# EasyEDA Pro project 4T模拟赛-董海玄.epro

# Schematic SCH
Board Name: Board1; Create Date: 2026-02-26; Page Name: GD32 主控电路; Project Name: Project; Schematic Name: SCH; Update Date: 2026-03-06
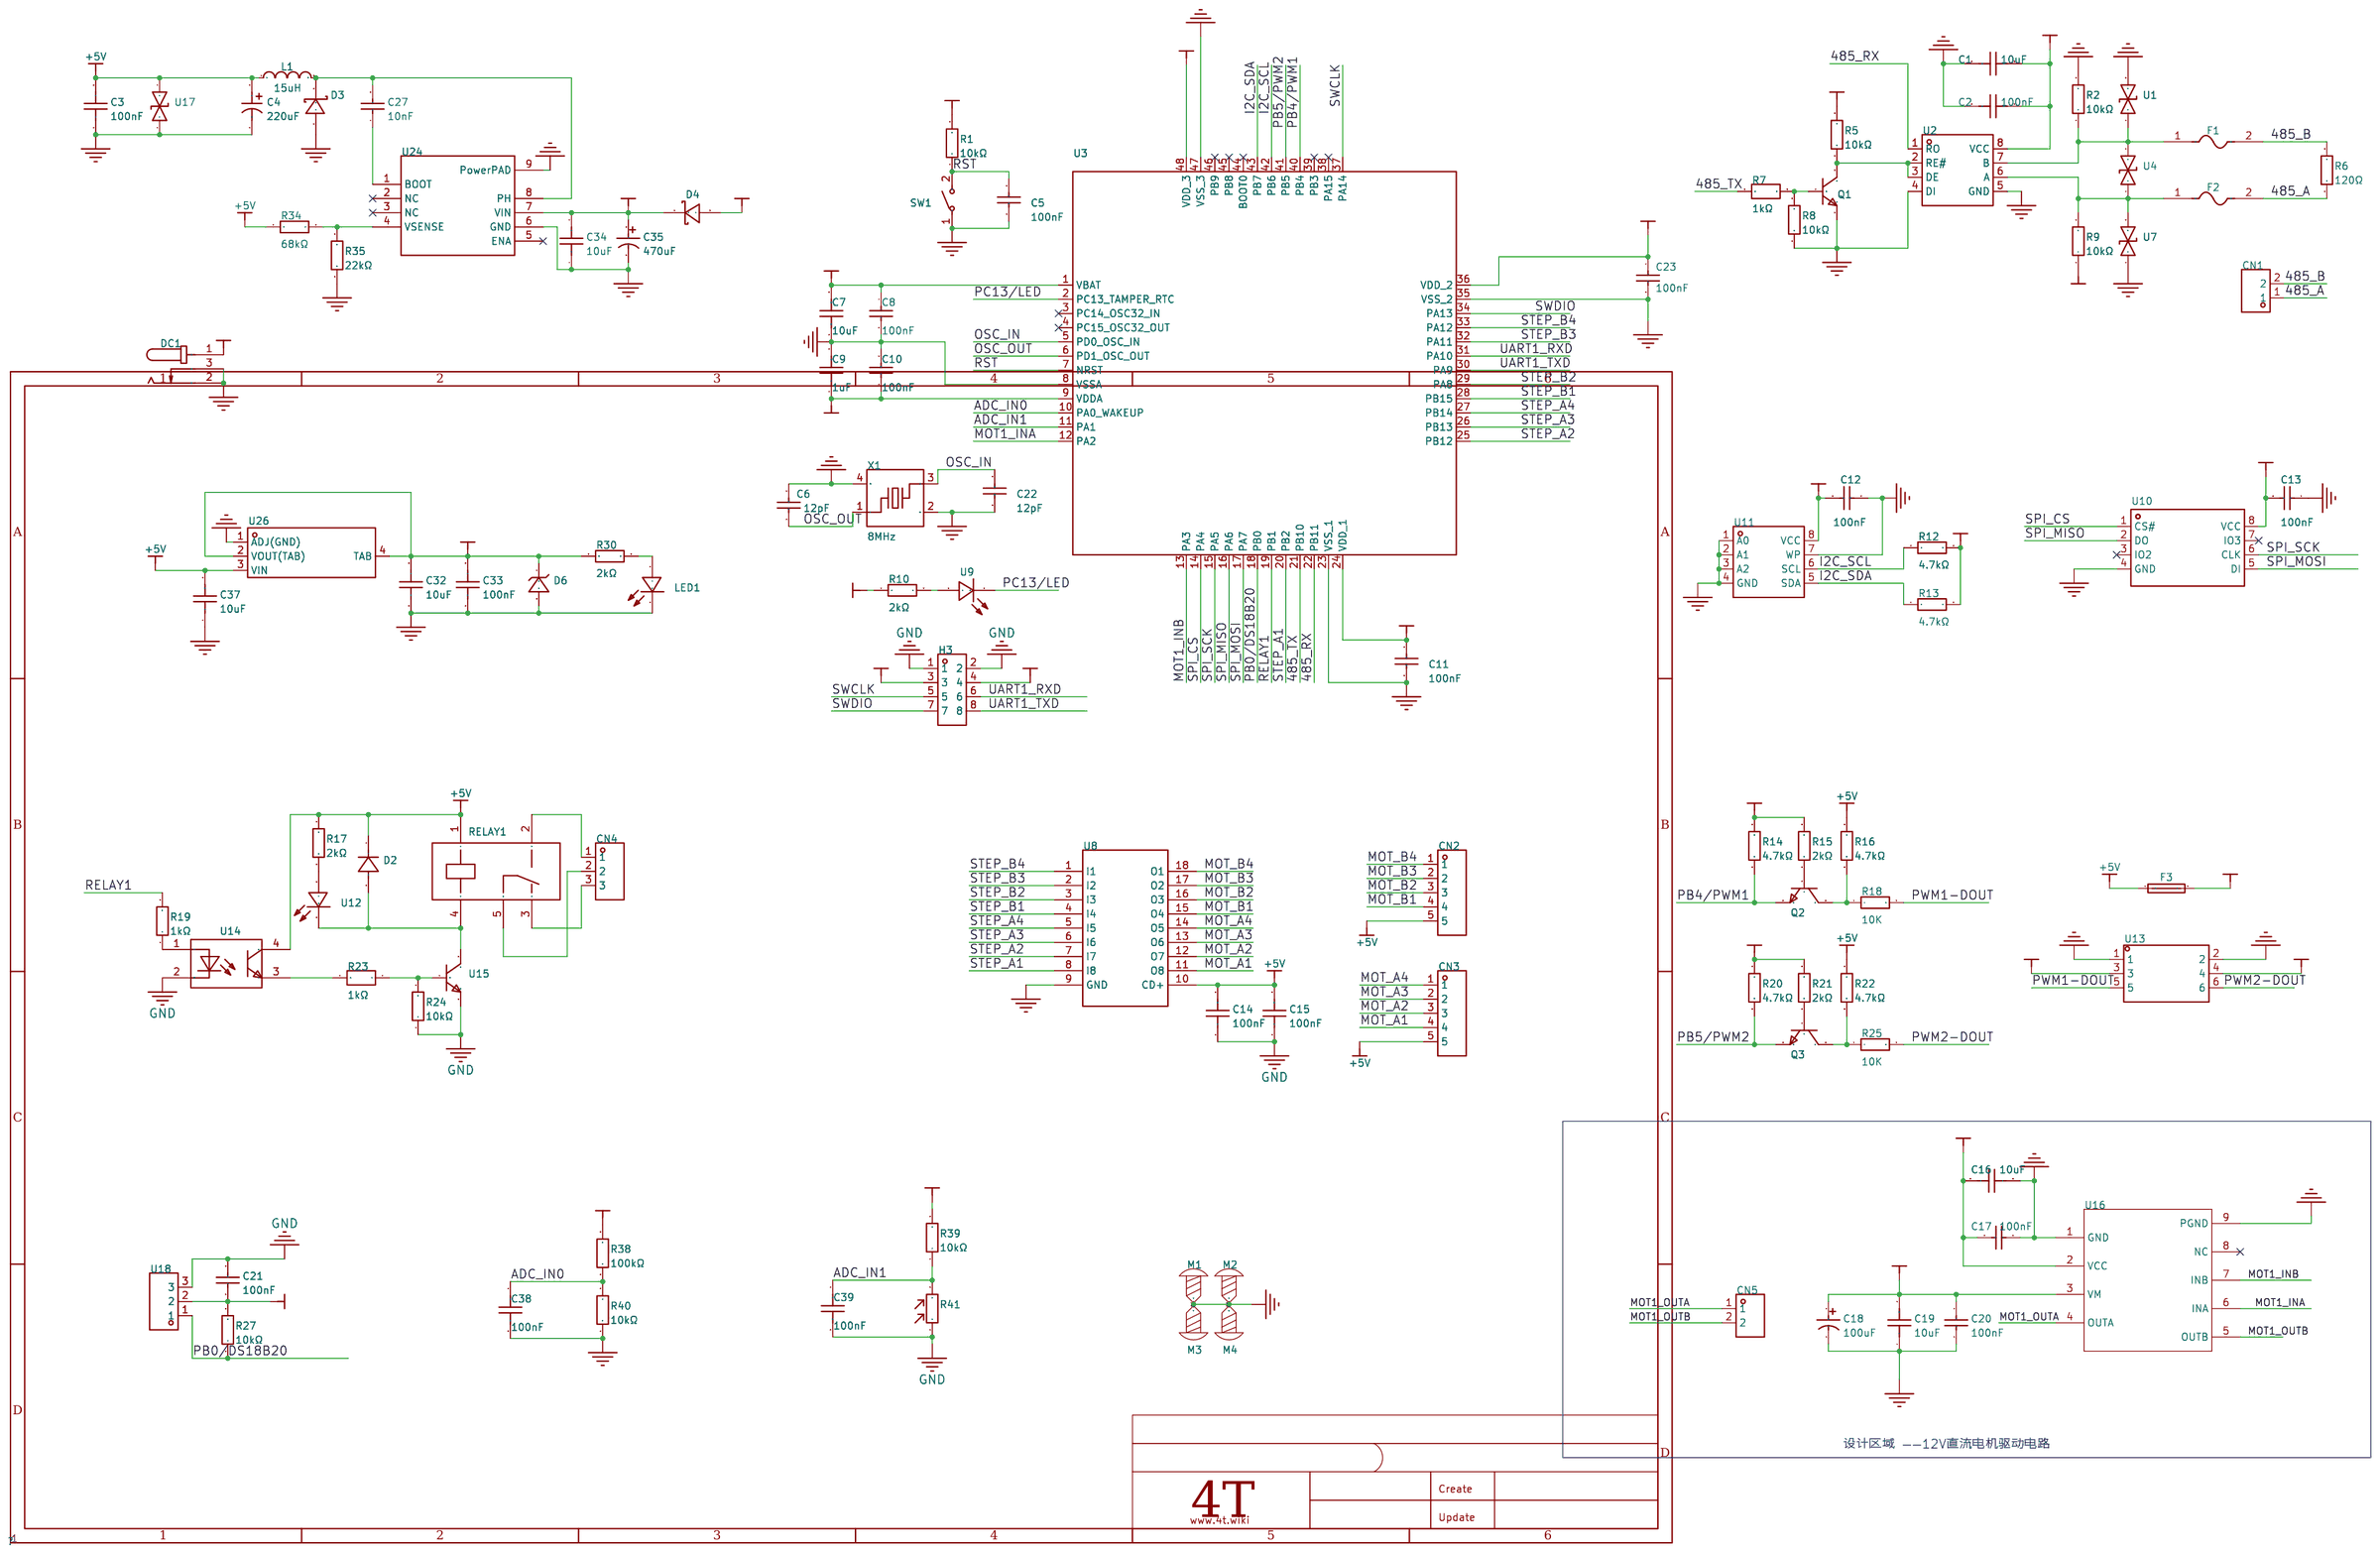
[diagram p0: schematic sheet]

## Parts
C1  10uF  [LQ_R0603]
C2  100nF  [LQ_R0603]
C3  100nF  [LQ_C0805]
C4  220uF  [LQ_CAP-SMD_BD6.3-L6.6-W6.6-LS7.3-FD-H7.7]
C5  100nF  [LQ_R0603]
C6  12pF  [LQ_R0603]
C7  10uF  [LQ_R0603]
C8  100nF  [LQ_R0603]
C9  1uF  [LQ_R0603]
C10  100nF  [LQ_R0603]
C11  100nF  [LQ_R0603]
C12  100nF  [LQ_R0603]
C13  100nF  [LQ_R0603]
C14  100nF  [LQ_C0805]
C15  100nF  [LQ_C0805]
C16  10uF  [LQ_R0603]
C17  100nF  [LQ_R0603]
C18  100uF  [LQ_CAP-SMD_BD6.3-L6.6-W6.6-LS7.3-FD-H7.7]
C19  10uF  [LQ_R0603]
C20  100nF  [LQ_R0603]
C21  100nF  [LQ_R0603]
C22  12pF  [LQ_R0603]
C23  100nF  [LQ_R0603]
C27  10nF  [LQ_R0603]
C32  10uF  [LQ_R0603]
C33  100nF  [LQ_R0603]
C34  10uF  [LQ_C0805]
C35  470uF  [LQ_CAP-SMD_BD8.0-L8.3-W8.3-FD]
C37  10uF  [LQ_R0603]
C38  100nF  [LQ_R0603]
C39  100nF  [LQ_R0603]
CN1  -  [LQ_CONN-TH_2P-P5.08_DB128L-5.08-2P]
CN2  -  [LQ_CONN-TH_5P-P2.54_XH-5AW_C2908614]
CN3  -  [LQ_CONN-TH_5P-P2.54_XH-5AW_C2908614]
CN4  -  [LQ_CONN-TH_3P-P5.00_KF2EDGR-5.0-3P]
CN5  -  [LQ_CONN-TH_2P-P5.08_DB128L-5.08-2P]
D2  1N4007  [LQ_SMA_L4.3-W2.5-LS5.0-RD]
D3  SS34  [LQ_SMA_L4.3-W2.6-LS5.0-RD]
D4  SS34  [LQ_SMA_L4.3-W2.6-LS5.0-RD]
D6  -  [LQ_SMB_L4.3-W3.6-LS5.3-RD]
DC1  -  [LQ_DC-IN-TH_DC-005-A200]
F1  -  [LQ_R0805]
F2  -  [LQ_R0805]
F3  -  [LQ_R0603]
H3  -  [LQ_HDR-TH_8P-P2.54-V-F-R2-C4-S2.54-1]
L1  15uH  [LQ_IND-SMD_L10.8-W10.0_SLO1040H]
LED1  -  [LQ_LED0603-RD]
M1  -  [LQ_M3螺丝]
M2  -  [LQ_M3螺丝]
M3  -  [LQ_M3螺丝]
M4  -  [LQ_M3螺丝]
Q1  -  [LQ_SC-75-3_L1.6-W0.8-P1.00-LS1.6-BR]
Q2  S8050-J3Y  [LQ_SOT-23-3_L3.0-W1.7-P0.95-LS2.9-BR]
Q3  S8050-J3Y  [LQ_SOT-23-3_L3.0-W1.7-P0.95-LS2.9-BR]
R1  10kΩ  [LQ_R0603]
R2  10kΩ  [LQ_R0603]
R5  10kΩ  [LQ_R0603]
R6  120Ω  [LQ_R0805]
R7  1kΩ  [LQ_R0603]
R8  10kΩ  [LQ_R0603]
R9  10kΩ  [LQ_R0603]
R10  2kΩ  [LQ_R0603]
R12  4.7kΩ  [LQ_R0603]
R13  4.7kΩ  [LQ_R0603]
R14  4.7kΩ  [LQ_R0603]
R15  2kΩ  [LQ_R0603]
R16  4.7kΩ  [LQ_R0603]
R17  2kΩ  [LQ_R0603]
R18  10K  [LQ_R0603]
R19  1kΩ  [LQ_R0603]
R20  4.7kΩ  [LQ_R0603]
R21  2kΩ  [LQ_R0603]
R22  4.7kΩ  [LQ_R0603]
R23  1kΩ  [LQ_R0603]
R24  10kΩ  [LQ_R0603]
R25  10K  [LQ_R0603]
R27  10kΩ  [LQ_R0603]
R30  2kΩ  [LQ_R0603]
R34  68kΩ  [LQ_R0603]
R35  22kΩ  [LQ_R0603]
R38  100kΩ  [LQ_R0603]
R39  10kΩ  [LQ_R0603]
R40  10kΩ  [LQ_R0603]
R41  -  [LQ_RES-TH_L5.1-W4.3-P3.40-D0.5]
RELAY1  -  [LQ_RELAY-TH_SRD-XXVDC-XL-C_1]
SW1  -  [LQ_SW-SMD_L6.0-W3.3-LS8.0]
U1  -  [LQ_SOD-123FL_L2.8-W1.8-LS3.7-BI]
U2  -  [LQ_SOP-8_L4.9-W3.9-P1.27-LS6.0-BL]
U3  -  [LQ_TQFP-48_L7.0-W7.0-P0.50-LS9.0-BL]
U4  -  [LQ_SOD-123FL_L2.8-W1.8-LS3.7-BI]
U7  -  [LQ_SOD-123FL_L2.8-W1.8-LS3.7-BI]
U8  -  [LQ_DIP-18_L23.0-W6.5-P2.54-LS7.6-BL]
U9  -  [LQ_LED-TH_BD3.9-P2.54-RD_GREEN]
U10  -  [LQ_SOIC-8_L5.3-W5.3-P1.27-LS8.0-BL]
U11  AT24C02  [LQ_SOP-8_L4.9-W3.9-P1.27-LS6.0-BL]
U12  -  [LQ_LED-TH_BD3.9-P2.54-RD_GREEN]
U13  -  [LQ_HDR-TH_6P-P2.54-H-R2-C3-S2.54-W10.0_MTP125-203R1]
U14  GX817C-S  [LQ_SOP-4_L6.5-W4.6-P2.54-LS10.2-TR]
U15  -  [LQ_SOT-23-3_L2.9-W1.3-P1.90-LS2.4-BR]
U16  -  [ESOP]
U17  -  [LQ_SOD-123FL_L2.8-W1.8-LS3.7-BI]
U18  -  [LQ_CONN-TH_3P-P5.08_DIBO_DB128V-5.08-3P-X]
U24  -  [LQ_ESOP-8_L4.9-W3.9-P1.27-LS6.0-TL-EP]
U26  -  [LQ_OSC-SMD_4P-L3.2-W2.5-BL]
X1  8MHz  [LQ_OSC-SMD_4P-L3.2-W2.5-BL]

## Library data of the parts
C1 C2 C5-C13 C16 C17 C19-C23 C27 C32 C33 C37-C39 = CAP_0603: Rect,100,35
C3 C14 C15 C34 = CAP_0805: Rect,130,53
C4 C18 = JVJ50V100M6x8: Round,260; LCSC Part Name: 100uF ±20% 50V; Supplier Footprint: SMD,D6.3xL7.7mm; JLCPCB Part Class: 扩展库; Datasheet: https://atta.szlcsc.com/upload/public/pdf/source/20250307/5A84A08C3F2F96A6D3F2CE3F7352019C.pdf; Tolerance: ±20%; Voltage Rating: 50V; Ripple Current: 140mA@100Hz; Diameter: 6.3mm; Height - Seated (Max): 7.7mm; Lifetime: 2000hrs@105℃; Operating Temperature: -55℃~+105℃
C35 = VT1V221M0810: Round,314; LCSC Part Name: 220uF ±20% 35V; Supplier Footprint: SMD,D8xL10.2mm; Datasheet: https://atta.szlcsc.com/upload/public/pdf/source/20181008/C310848_86A97ADD3BC640D301817E47C029682B.pdf; Tolerance: ±20%; Rated Voltage: 35V; φD: 8mm; L: 10.2mm; Lifetime @ Temp: 2000hrs@105℃; Operating Temperature: -45℃~+105℃
CN1 CN5 = DB128L-5.08-2P-GN-S: Rect,383,380; LCSC Part Name: 5.08mm 1x2P 排数:1 每排P数:2 直插; Supplier Footprint: 插件,P=5.08mm; Datasheet: https://atta.szlcsc.com/upload/public/pdf/source/20230106/B067FE0E641A396A370D47F93C345689.pdf; Structure: 1x2P; Pitch: 5.08mm; Color: 绿色; Mounting Style: 直插; Current Rating (Max): 18A; Voltage Rating (Max): 250V; Number of Pins: 2P; Number of Rows: 1; Wire Gauge - AWG: 12~30; Wire Gauge - mm2: 2.5; Number of PINs Per Row: 2; Operating Temperature Range: -40℃~+105℃
CN2 CN3 = XH-5AW: Rect,570,274; LCSC Part Name: 1x5P 间距:2.54mm 弯插 系列:XH; Supplier Footprint: 弯插,P=2.5mm; Datasheet: https://atta.szlcsc.com/upload/public/pdf/source/20230711/B565BAF3B11666EF6B81B3605408F2BD.pdf; Pins Structure: 1x5P; Pitch: 2.54mm; Mounting Style: 弯插; Reference Series: XH; Number of Pins: 5P; Number of Rows: 1; Number of PINs Per Row: 5; Current Rating (Max): 3A; Contact Material: 黄铜; Contact Plating: 锡; Operating Temperature Range: -25℃~+85℃
CN4 = KF2EDGR-5.0-3P: Rect,588,461; LCSC Part Name: 5mm 1x3P 排数:1 每排P数:3; Supplier Footprint: 弯插,P=5mm; Datasheet: https://atta.szlcsc.com/upload/public/pdf/source/20230331/48F85325430F02148BE2AB264324A8EA.pdf; Connector Type: 板端/插座-开口; Structure: 1x3P; Pitch: 5mm; Color: 绿色; Mounting Style: 弯针; Number of Pins: 3P; Number of Rows: 1; Number of PINs Per Row: 3; Current Rating (Max): 15A; Voltage Rating (Max): 300V; Operating Temperature Range: -40℃~+105℃
D2 = 1N4007_C727081: Rect,237,58; LCSC Part Name: 1kV 1A 1.1V@1A; Supplier Part: C727081; Manufacturer: TWGMC(台湾迪嘉); Supplier Footprint: SMA(DO-214AC); Datasheet: https://atta.szlcsc.com/upload/public/pdf/source/20200828/C727079_3A05254382567072883400655AE0ED46.pdf; Supplier: LCSC; Diode Configuration: 独立式; Reverse Voltage (Vr): 1kV; Average Rectified Current (Io): 1A; Forward Voltage (Vf@If): 1.1V@1A; Reverse Leakage Current: 5μA@1kV
D3 D4 = SS34: Rect,184,107; Supplier Part: C9900023345; Supplier Footprint: SMA,DO-214AC; Supplier: LCSC
D6 = SMBJ3.3A_C2990571: Rect,190,130; LCSC Part Name: SMBJ3.3A; Supplier Footprint: SMB(DO-214AA); Datasheet: https://atta.szlcsc.com/upload/public/pdf/source/20180716/C29715_E6EABBF81195B419C59879CD6F1DD929.pdf; Reverse Stand-Off Voltage (Vrwm): 3.3V; Maximum Clamping Voltage: 7.2V; Peak Pulse Current (Ipp)@10/1000us: 42A; Peak Pulse Power Dissipation (Ppp)@10/1000us: 300W; Breakdown Voltage: 4V; Reverse Leakage Current (Ir): 10uA; Type: TVS
DC1 = DC-005-A200: Rect,533,335; LCSC Part Name: DC电源插座 内径:2mm 外径:6.4mm; Supplier Footprint: 插件; JLCPCB Part Class: 扩展库; Datasheet: https://atta.szlcsc.com/upload/public/pdf/source/20200812/C720557_2286DFCD6C75B71AF905731F627ABF3A.pdf; Connector Type: DC电源插座; Mounting Style: 弯插; Inside Contact Diameter: 2mm; Outside Contact Diameter: 6.4mm; Current Rating (Max): 3A; Voltage Rating (Max): 30V; Operating Temperature Range: -20℃~+70℃
F1 F2 = 0805L100/12AR: Rect,154,63; LCSC Part Name: 12V 1A 0805自恢复; Supplier Footprint: 0805; Datasheet: https://atta.szlcsc.com/upload/public/pdf/source/20230807/C79B608779D6C1962D0609D5DE753A5D.pdf; Operating Voltage (Max): 12V; Current Rating (Max): 40A; Hold Current: 1A; Trip Current: 2A; Power Dissipation: 800mW; Resistance - Initial (Ri) (Min): 40mΩ; Resistance - Post Trip (R1) (Max): 270mΩ; Maximum Time to Trip: 300ms; Operating Temperature: -40℃~+85℃
F3 = BSMD0603L-100: Rect,86,27; LCSC Part Name: 6V 1A 0603自恢复; Supplier Footprint: 0603; Datasheet: https://atta.szlcsc.com/upload/public/pdf/source/20230512/417309B2F369BEFF09D3B47B4F479194.pdf; Operating Voltage (Max): 6V; Current Rating (Max): 50A; Hold Current: 1A; Trip Current: 2A; Power Dissipation: 1W; Resistance - Initial (Ri) (Min): 9mΩ; Resistance - Post Trip (R1) (Max): 80mΩ; Maximum Time to Trip: 500ms; Operating Temperature: -40℃~+85℃
H3 = HDR-F_2.54_2x4: Rect,405,186; Supplier Footprint: 插件
L1 = SLO1040H470MTT: Rect,431,399; LCSC Part Name: 47uH ±20%; Supplier Footprint: SMD; JLCPCB Part Class: 扩展库; Datasheet: https://atta.szlcsc.com/upload/public/pdf/source/20201009/C207854_ACA4210DD273ACBB198904FC5A3A8806.pdf; Tolerance: ±20%; Rated Current: 3A; DC Resistance (DCR): 145mΩ
LED1 = KT-0603R: Rect,92,33; LCSC Part Name: 0603 红灯 高亮; Supplier Footprint: 0603; Datasheet: https://atta.szlcsc.com/upload/public/pdf/source/20160616/1466072038404.pdf; Emitted Color: 红色; Operating Temperature: -40℃~+85℃
M1-M4 = M3螺丝孔: Round,210
Q1 = MMBT3904TT1G: Rect,29,63; LCSC Part Name: NPN 电流:200mA 耐压:40V; Supplier Footprint: SOT-416; Datasheet: https://atta.szlcsc.com/upload/public/pdf/source/20221020/8C70A8ED36C1D333CEA0E7EE045B4434.pdf; Transistor Type: NPN; Collector Current (Ic): 200mA; Collector-Emitter Breakdown Voltage (Vceo): 40V; Power Dissipation (Pd): 200mW; DC Current Gain (hFE@Ic,Vce): 100@0.1mA,1.0V; Transition Frequency (fT): 300MHz; Collector Cut-Off Current (Icbo): 50nA; Collector-Emitter Saturation Voltage (VCE(sat)@Ic,Ib): 200mV@10mA,1.0mA; Operating Temperature: -65℃~+150℃
Q2 Q3 = S8050-J3Y: Rect,67,120; Pin Type: IN
R1 R2 R5 R7-R10 R12-R25 R27 R30 R34 R35 R38-R40 = Res_0603: Rect,95,37
R6 = Res_0805: Rect,125,54
R41 = GL5528: Round,162; LCSC Part Name: 亮电阻:8kΩ~20kΩ 暗电阻:1MΩ; Supplier Footprint: 插件,P=3mm; Datasheet: https://atta.szlcsc.com/upload/public/pdf/source/20230427/842A99E3D53A83729D7968886D4EFCBB.pdf; Dark Resistance: 1MΩ; Illuminated Resistance @ 10Lux: 8kΩ~20kΩ; Applied Voltage: 150V; Spectral Peak: 540nm
RELAY1 = SRD-12VDC-SL-C: Rect,740,600; Supplier Footprint: 插件,15.6x19.2mm; Datasheet: https://atta.szlcsc.com/upload/public/pdf/source/20200305/C490149_C96E4098A3B1FFB377D5AD2E40B7C2A8.pdf; Coil Voltage: 12V; Contact Form: 一组转换:1C(单刀双掷-转换); Pin Number: 5; Maximum Switching Voltage: 250V@AC; Coil Rated Power: 360mW; Maximum Switching Current: 15A; Coil Type: 无极性-单线圈; Coil Resistance: 400Ω; Contact Resistance: 100mΩ; Operate Time: 10ms; Release Time: 10ms
SW1 = TS-1101-C-W: Rect,236,129; LCSC Part Name: 6*3.6*2.5mm 立贴 轻触开关; Supplier Footprint: SMD; Datasheet: https://atta.szlcsc.com/upload/public/pdf/source/20200227/C318938_C2E53B1EEDE37D980A33616AC086DE53.pdf; Circuit: 单刀单掷; Actuator Style: 矩形按钮; Operating Force: 260gf; Mounting Style: 立贴; Switch Length: 6mm; Switch Width: 3.6mm; Switch Height: 2.5mm; Strike Gundam: 不带; Contact Current: 50mA; Voltage Rating (DC): 12V; Actuator/Cap Color: 白色带淡绿; With Lamp: 无; Mechanical Life: 5万次; Operating Temperature: -30℃~+85℃
U1 U4 U7 U17 = SMF6.0CA_C2990473: Rect,173,48; LCSC Part Name: SMF6.0CA; Supplier Footprint: SOD-123FL; Datasheet: https://atta.szlcsc.com/upload/public/pdf/source/20231227/BBF9EE757846DE4D601D73FF261316E0.pdf; Reverse Stand-Off Voltage (Vrwm): 6V; Maximum Clamping Voltage: 10.3V; Peak Pulse Current (Ipp)@10/1000us: 19.4A; Peak Pulse Power Dissipation (Ppp)@10/1000us: 200W; Breakdown Voltage: 6.67V; Reverse Leakage Current (Ir): 400uA; Type: TVS
U2 = SP3485EN-MS: Rect,196,115; Supplier Footprint: SOP-8; Datasheet: https://atta.szlcsc.com/upload/public/pdf/source/20230802/AC5CE9B297C842978E478FFAEC87FC06.pdf; Types: 收发器; Supply Voltage: 3V~5.5V; Data Rate: 12Mbps; Driver/receiver: 1/1; Node Number: 256; Operating Temperature: -40℃~+125℃
U3 = GD32F103C8T6: Rect,216,216; LCSC Part Name: Arm® Cortex®-M3 32-bit MCU; Supplier Footprint: LQFP-48(7x7); Datasheet: https://item.szlcsc.com/datasheet/GD32F103C8T6/79128.html; CPU Core: ARM Cortex-M3; CPU Maximum Speed: 108MHz; Program Storage Size: 64KB; Program Memory Type: FLASH; Number of I/O: 37; ADC (Bit): 12bit; Voltage - Supply: 2.6V~3.6V
U8 = ULN2803G-D18-T: Rect,889,235; Supplier Footprint: DIP-18; Datasheet: https://atta.szlcsc.com/upload/public/pdf/source/20160620/1466410514366.pdf; number of channels: 八路
U9 U12 = L-3N4GD: Round,140; Supplier Footprint: 插件,D=3mm; Datasheet: https://atta.szlcsc.com/upload/public/pdf/source/20220613/52FE11107FC1247DC989221133187A30.pdf; Lamp Holder Type: 3mm圆柱形灯头
U10 = W25Q128JVSIQ: Rect,207,171; LCSC Part Name: W25Q128JVSIQ 编带; Supplier Footprint: SOIC-8-208mil; JLCPCB Part Class: 基础库; Datasheet: https://atta.szlcsc.com/upload/public/pdf/source/20170316/1489627409956.pdf; Interface Type: SPI; Memory Size: 128Mbit; Clock Frequency (fc): 133MHz; Supply Voltage: 2.7V~3.6V; Page Programming Time (Tpp): 700us; Block Erase Time (tBE): 120ms@(32KB); Data Retention - TDR (Year): 20年; Operating Temperature: -40℃~+85℃
U11 = AT24C02: Rect,196,115; link: https://so.szlcsc.com/global.html?k=C356696&ref=editor
U13 = MTP125-1203R1: Rect,250,529; LCSC Part Name: 2.54mm 2x3P 弯插 方针; Supplier Footprint: 弯插,P=2.54mm; Datasheet: https://atta.szlcsc.com/upload/public/pdf/source/20190124/C358705_93D7A3916447F5E30395220E465CA216.pdf; Number of Rows: 双排; Number of Pins: 6; Pitch: 2.54mm; Pin Structure: 2x3P; Row Spacing: 2.54mm; Mounting Type: 弯插; Circluar Pins/Square Pins: 方针; Length of Mating Pin: 6mm; Insulation Height: 2.5mm; Contact Material: 黄铜; Operating Temperature Range: -40℃~+105℃; Color: 黑色
U14 = GX817C-S: Rect,154,463; LCSC Part Name: DC输入 隔离电压(rms):5000V; Supplier Part: C2684625; Manufacturer: 国芯佳品; Supplier Footprint: SOP-4-2.54mm; Datasheet: https://atta.szlcsc.com/upload/public/pdf/source/20210129/C2684625_70920EABE5B67CAA0A333F7D1CED43F0.pdf; Supplier: LCSC; Input voltage type: DC; Output Type: 光电三极管; Number of Outputs: 1; Forward Voltage: 1.2V; Reverse Voltage: 6V; Output Current: 50mA; Receiving End Voltage: 35V; Collector-Emitter Saturation Voltage (Vce(sat)@Ic,IF): 100mV@1mA,20mA; Rise time: 18us@2mA,100Ω; Fall time: 18us@2mA,100Ω; Isolation Voltage(rms): 5kV; Operating Temperature: -55℃~+110℃
U15 = SS8050_C7420370: Rect,53,116; LCSC Part Name: 耐压:25V 电流:1.5A NPN H档 200-350; Supplier Footprint: SOT-23; Datasheet: https://atta.szlcsc.com/upload/public/pdf/source/20231222/9C4050A7669EB24B3ACD0418218817FD.pdf; Transistor Type: NPN; Collector Current (Ic): 1.5A; Collector-Emitter Breakdown Voltage (Vceo): 25V; Power Dissipation (Pd): 300mW; DC Current Gain (hFE@Ic,Vce): 120@100mA,1.0V; Transition Frequency (fT): 100MHz; Collector Cut-Off Current (Icbo): 100nA; Collector-Emitter Saturation Voltage (VCE(sat)@Ic,Ib): 500mV@800mA,80mA; Operating Temperature: -55℃~+150℃
U16 = BDR
U18 = DB128V-5.08-3P-GN-S: Rect,600,394; LCSC Part Name: 1x3P 5.08mm 直插 排数:1 每排P数:3; Supplier Footprint: 插件,P=5.08mm; JLCPCB Part Class: 扩展库; Datasheet: https://atta.szlcsc.com/upload/public/pdf/source/20230106/CC449C10514519CDCE20F1C37DBF2DAC.pdf; Number of Positions or Pins: 1x3P; Pitch: 5.08mm; Color: 绿色; Mounting Type: 直插; Number of Pins: 3P; Number of Rows: 1; Number of PINs Per Row: 3; Screw Specification: M2.5; Current Rating: 16A; Voltage Rating (Max): 300V; Wire Gauge - AWG: 12~22; Wire Gauge - mm2: 2.5; Operating Temperature: -40℃~+105℃
U24 = TPS5430DDAR: Rect,159,190; LCSC Part Name: 宽输入范围、3A输出电流的降压转换器; Supplier Footprint: SOIC-8-EP; Datasheet: https://www.ti.com/cn/lit/gpn/tps5430; Function: 降压型; Output Type: 可调; Input Voltage: 5.5V~36V; Output Voltage: 1.221V~32.04V; Output Current: 3A; Switching Frequency: 500kHz; Operating Temperature: -40℃~+125℃@(TJ); Synchronous Rectification: 否; Number of Outputs: 1; Topology: 降压式; Switch tube (built-in/external): 内置
U26 = AMS1117-1.8_C6185: Rect,90,248; LCSC Part Name: 正 Vin=15V Vout=1.8V~1.8V 1A 75dB@(120Hz); Supplier Footprint: SOT-223-4; Datasheet: https://atta.szlcsc.com/upload/public/pdf/source/20180727/C6186_7A095716F0823C02F1997A905E26C086.pdf; Output Type: 固定; Output Polarity: 正; Number of Outputs: 1; Maximum Input Voltage: 15V; Output Voltage: 1.8V~1.8V; Dropout Voltage: 1.3V@(1A); Output Current: 1A; Power Supply Rejection Ratio (PSRR): 75dB@(120Hz)
X1 = X322512MSB4SI: Rect,159,130; LCSC Part Name: 12MHz ±10ppm 20pF; Supplier Footprint: SMD3225-4P; Datasheet: https://atta.szlcsc.com/upload/public/pdf/source/20240329/19D5F850207469550BEB00D7DFEDBC7A.pdf; Crystal Type: 贴片晶振; Normal temperature Frequency Tolerance: ±10ppm; External load capacitor: 20pF; Frequency Stability(Full temperature range): ±20ppm; Operating Temperature: -40℃~+85℃

## Nets
3V3: C1.1 C2.1 C7.2 C8.1 C9.1 C10.1 C11.1 C12.1 C13.2 C16.1 C17.2 C21.2 C23.1 C32.2 C33.2 D6.1(C) H3.3 H3.4 R1.2 R5.2 R9.1 R10.1 R12.2 R13.2 R14.1 R15.2 R20.1 R21.2 R27.2 R30.2 R39.2 U2.8(VCC) U3.1(VBAT) U3.9(VDDA) U3.24(VDD_1) U3.36(VDD_2) U3.48(VDD_3) U10.8(VCC) U11.8(VCC) U16.2(VCC) U18.2 U26.2(VOUT(TAB)) U26.4(TAB)
+5V: C3.2 C4.1 C14.2 C15.2 C37.2 CN2.5 CN3.5 D2.1(K) F3.1 L1.1 R16.1 R17.1 R22.1 R34.1 RELAY1.1 U8.10(CD+) U14.4(C) U17.1 U26.3(VIN)
+5V-OUT: F3.2 U13.3 U13.4
+12V: C18.1 C19.2 C20.1 C34.2 C35.1 D4.1(K) U16.3(VM) U24.7(VIN)
GND: C1.2 C2.2 C3.1 C4.2 C5.2 C6.2 C7.1 C8.2 C9.2 C10.2 C11.2 C12.2 C13.1 C14.1 C15.1 C16.2 C17.1 C18.2 C19.1 C20.2 C21.1 C22.1 C23.2 C32.1 C33.1 C34.1 C35.2 C37.1 C38.2 C39.2 D3.2(A) D6.2(A) DC1.2 DC1.3 H3.1 H3.2 LED1.1(K) M1.1 M2.1 M3.1 M4.1 Q1.2(E) R2.2 R8.1 R24.1 R35.1 R40.1 R41.1 SW1.1 U1.2 U2.4(DI) U2.5(GND) U3.8(VSSA) U3.23(VSS_1) U3.35(VSS_2) U3.47(VSS_3) U7.1 U8.9(GND) U10.4(GND) U11.1(A0) U11.2(A1) U11.3(A2) U11.4(GND) U11.7(WP) U13.1 U13.2 U14.2(C) U15.2(E) U16.1(GND) U16.9(PGND) U17.2 U18.3 U24.6(GND) U24.9(PowerPAD) U26.1(ADJ(GND)) X1.2(GND) X1.4(GND)
VIN: D4.2(A) DC1.1 R38.2
485_A: CN1.1 F2.2 R6.1
485_B: CN1.2 F1.2 R6.2
485_RX: U2.1(RO) U3.22(PB11)
485_TX: R7.1 U3.21(PB10)
ADC_IN0: C38.1 R38.1 R40.2 U3.10(PA0_WAKEUP)
ADC_IN1: C39.1 R39.1 R41.2 U3.11(PA1)
I2C_SCL: R12.1 U3.42(PB6) U11.6(SCL)
I2C_SDA: R13.1 U3.43(PB7) U11.5(SDA)
MOT1_INA: U3.12(PA2) U16.6(INA)
MOT1_INB: U3.13(PA3) U16.7(INB)
MOT1_OUTA: CN5.1 U16.4(OUTA)
MOT1_OUTB: CN5.2 U16.5(OUTB)
MOT_A1: CN3.4 U8.11(O8)
MOT_A2: CN3.3 U8.12(O7)
MOT_A3: CN3.2 U8.13(O6)
MOT_A4: CN3.1 U8.14(O5)
MOT_B1: CN2.4 U8.15(O4)
MOT_B2: CN2.3 U8.16(O3)
MOT_B3: CN2.2 U8.17(O2)
MOT_B4: CN2.1 U8.18(O1)
OSC_IN: C22.2 U3.5(PD0_OSC_IN) X1.3
OSC_OUT: C6.1 U3.6(PD1_OSC_OUT) X1.1
PB0/DS18B20: R27.1 U3.18(PB0) U18.1
PB4/PWM1: Q2.2 R14.2 U3.40(PB4)
PB5/PWM2: Q3.2 R20.2 U3.41(PB5)
PC13/LED: U3.2(PC13_TAMPER_RTC) U9.1(C)
PWM1-DOUT: R18.2 U13.5
PWM2-DOUT: R25.2 U13.6
RELAY1: R19.2 U3.19(PB1)
RST: C5.1 R1.1 SW1.2 U3.7(NRST)
SPI_CS: U3.14(PA4) U10.1(CS#)
SPI_MISO: U3.16(PA6) U10.2(DO)
SPI_MOSI: U3.17(PA7) U10.5(DI)
SPI_SCK: U3.15(PA5) U10.6(CLK)
STEP_A1: U3.20(PB2) U8.8(I8)
STEP_A2: U3.25(PB12) U8.7(I7)
STEP_A3: U3.26(PB13) U8.6(I6)
STEP_A4: U3.27(PB14) U8.5(I5)
STEP_B1: U3.28(PB15) U8.4(I4)
STEP_B2: U3.29(PA8) U8.3(I3)
STEP_B3: U3.32(PA11) U8.2(I2)
STEP_B4: U3.33(PA12) U8.1(I1)
SWCLK: H3.5 U3.37(PA14)
SWDIO: H3.7 U3.34(PA13)
UART1_RXD: H3.6 U3.31(PA10)
UART1_TXD: H3.8 U3.30(PA9)
$1N1864: R10.2 U9.2(A)
$1N51292: Q3.1 R21.1
$1N51297: Q3.3 R22.2 R25.1
$1N64291: Q1.3(C) R5.1 U2.2(RE#) U2.3(DE)
$1N64303: F1.1 R2.1 U1.1 U2.7(B) U4.2
$1N64306: F2.1 R9.2 U2.6(A) U4.1 U7.2
$1N64546: Q1.1(B) R7.2 R8.2
$1N100307: R23.2 U14.3(E)
$1N100313: CN4.3 RELAY1.3
$1N100314: R23.1 R24.2 U15.1(B)
$1N100315: D2.2(A) RELAY1.4 U12.1(C) U15.3(C)
$1N100316: CN4.1 RELAY1.2
$1N100317: CN4.2 RELAY1.5
$1N101166: R19.1 U14.1(A)
$1N101509: Q2.1 R15.1
$1N101514: Q2.3 R16.2 R18.1
$1N108709: R17.2 U12.2(A)
$1N118569: LED1.2(A) R30.1
$1N118588: C27.2 D3.1(K) L1.2 U24.8(PH)
$1N118591: R34.2 R35.2 U24.4(VSENSE)
$1N118592: C27.1 U24.1(BOOT)

Not connected (* = marked no-connect by the designer): U3 3(PC14_OSC32_IN)* 4(PC15_OSC32_OUT)* 38(PA15)* 39(PB3)* 44(BOOT0)* 45(PB8)* 46(PB9)*; U10 3(IO2)* 7(IO3)*; U16 8(NC)*; U24 2(NC)* 3(NC)* 5(ENA)*

## Notes on the sheet
- 设计区域 ——12V直流电机驱动电路

# Board PCB
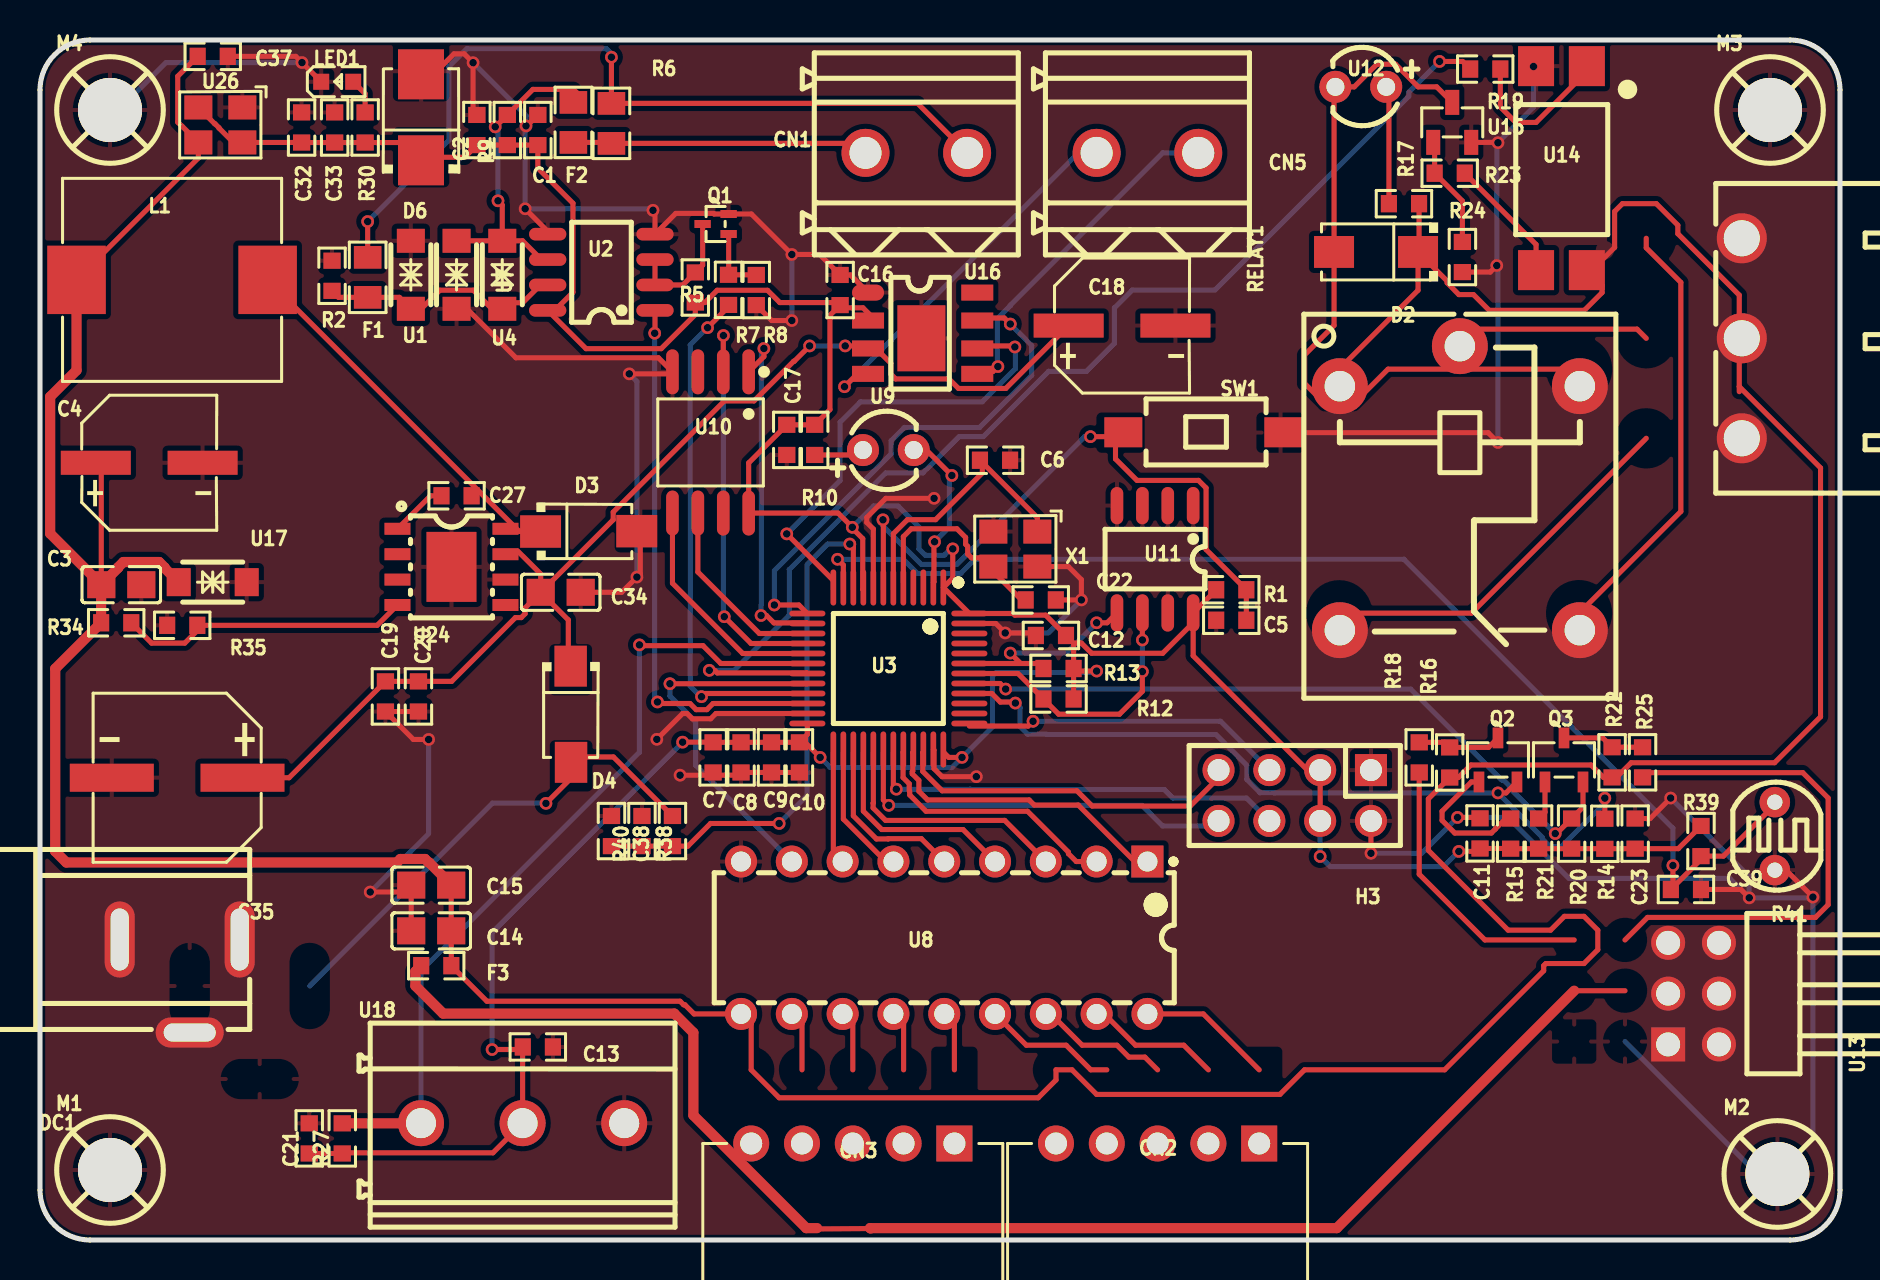
[diagram p1: board, top side]
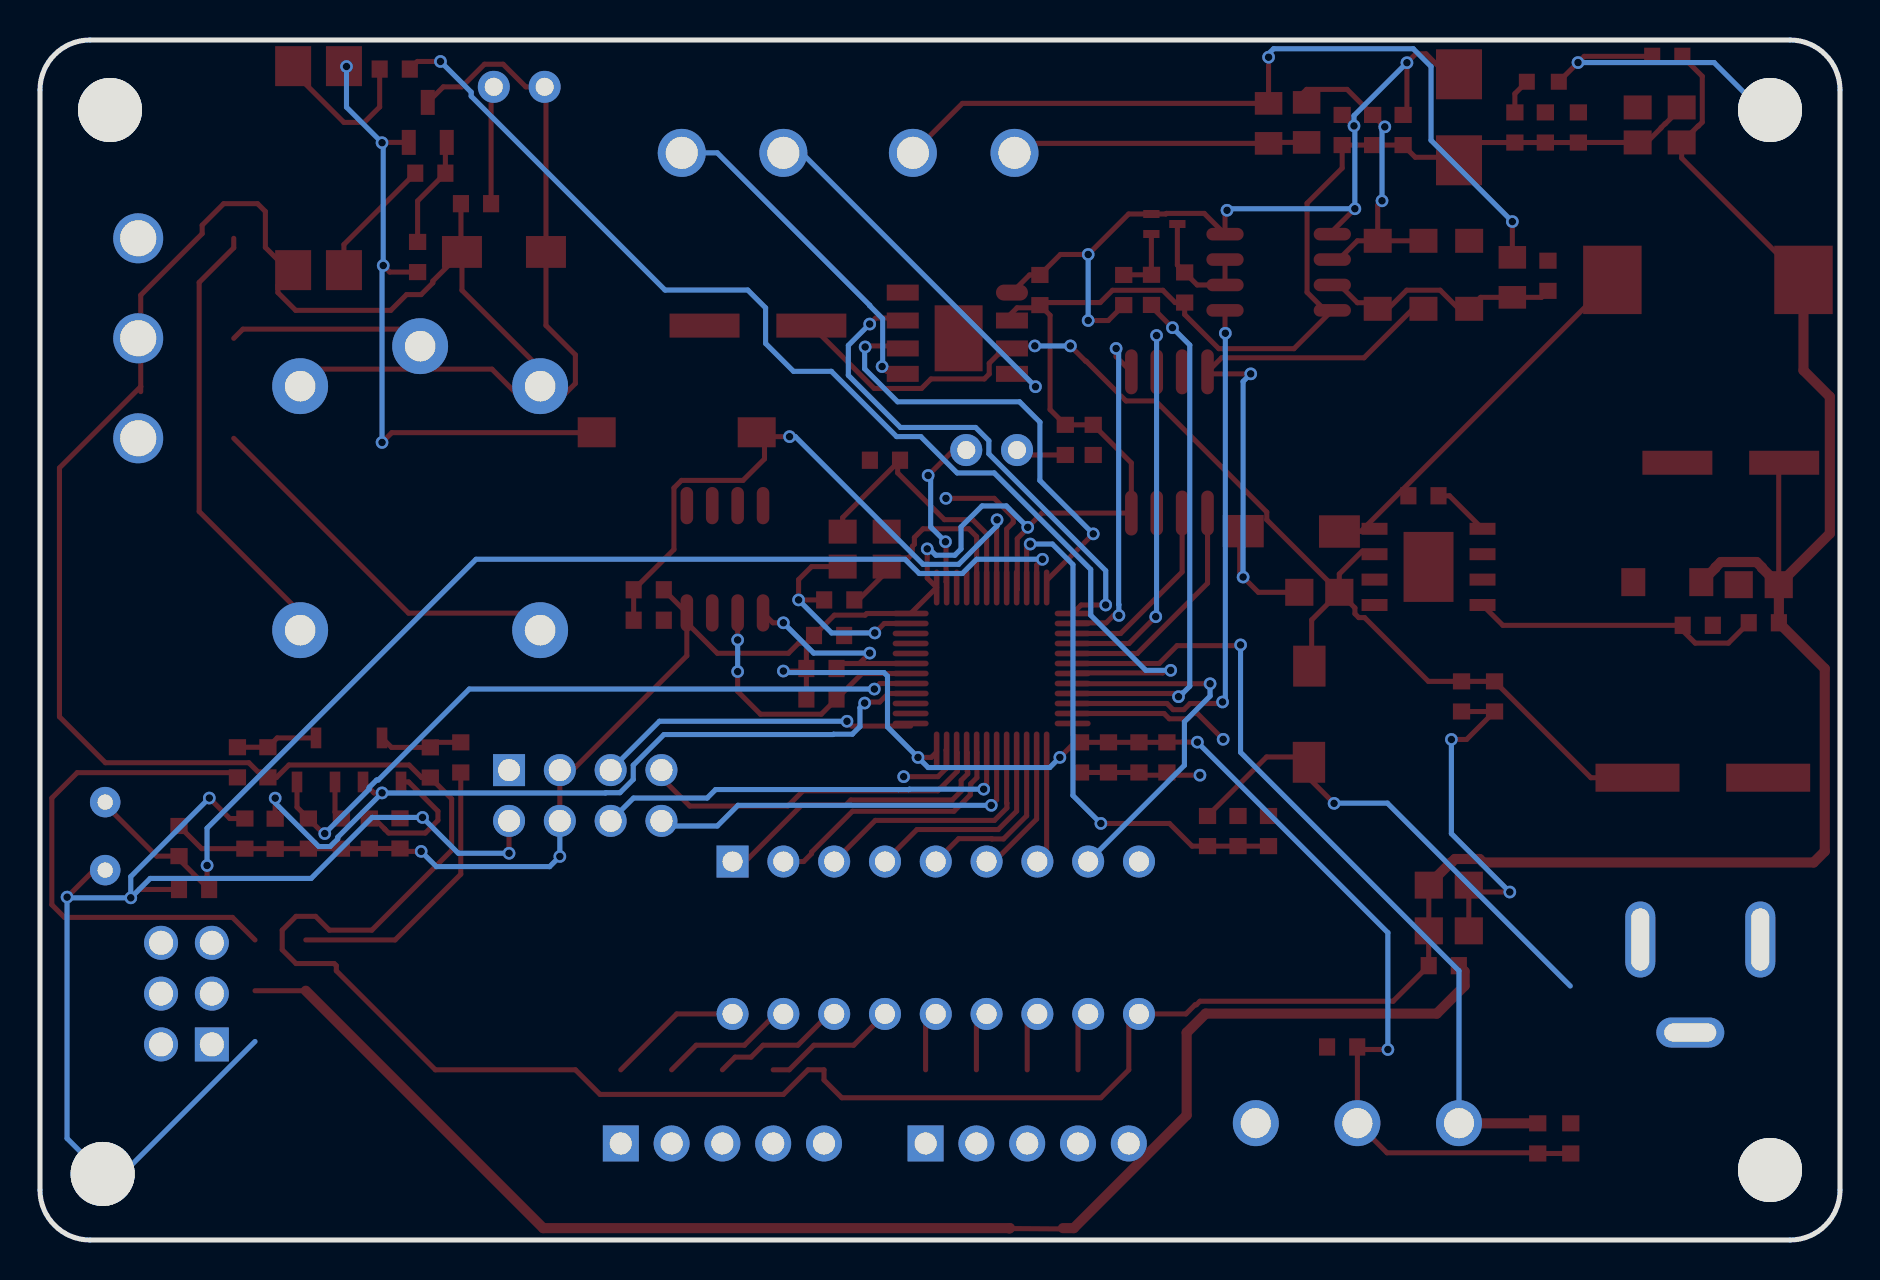
[diagram p2: board, bottom side, seen from below]

Outline 90 x 60 mm; copper layers: Top Layer, Bottom Layer. Coordinates in mm from the lower left corner of the outline.
Outline path: 0,57.5 0,2.5 arc(0.73,0.73) 2.5,0 87.5,0 arc(89.27,0.73) 90,2.5 90,57.5 arc(89.27,59.27) 87.5,60 2.5,60 arc(0.73,59.27) 0,57.5
Stack: Top Layer 0.035mm / Dielectric1 1.51mm FR4 er 4.5 / Bottom Layer 0.035mm

## Design rules (mm)
template: 自定义配置
spacing copperThickness1oz (default): track to track 0.203, other pairs 0.178 to 0.203
spacing copperThickness2oz: track to track 0.203, other pairs 0.152 to 0.3
track width copperThickness1oz (default): min 0.254, default 0.254, max 2.54
track width copperThickness2oz: min 0.203, default 0.254, max 2.54
differential pair differentialPair (default): width min 0.127, default 0.254, max 2.54; gap min 0.152, default 0.152
via viaSize (default): diameter min 0.635, default 0.635, max 10.16; hole min 0.381, default 0.381, max 10.16

## Placement (name value [footprint] x y rotation side)
C1  10uF  [LQ_R0603]  24.89 55.5 90 top
C2  100nF  [LQ_R0603]  21.84 55.5 90 top
C3  100nF  [LQ_C0805]  4.06 32.77 180 top
C4  220uF  [LQ_CAP-SMD_BD6.3-L6.6-W6.6-LS7.3-FD-H7.7]  5.46 38.86 0 top
C5  100nF  [LQ_R0603]  59.56 30.99 180 top
C6  12pF  [LQ_R0603]  47.75 38.99 0 top
C7  10uF  [LQ_R0603]  33.66 24.13 90 top
C8  100nF  [LQ_R0603]  35.05 24.13 270 top
C9  1uF  [LQ_R0603]  36.58 24.13 270 top
C10  100nF  [LQ_R0603]  37.97 24.13 270 top
C11  100nF  [LQ_R0603]  72 20.33 90 top
C12  100nF  [LQ_R0603]  50.55 30.23 180 top
C13  100nF  [LQ_R0603]  24.89 9.65 180 top
C14  100nF  [LQ_C0805]  19.56 15.46 0 top
C15  100nF  [LQ_C0805]  19.56 17.74 0 top
C16  10uF  [LQ_R0603]  40 47.5 90 top
C17  100nF  [LQ_R0603]  37.34 40 90 top
C18  100uF  [LQ_CAP-SMD_BD6.3-L6.6-W6.6-LS7.3-FD-H7.7]  54.1 45.72 0 top
C19  10uF  [LQ_R0603]  17.27 27.18 90 top
C20  100nF  [LQ_R0603]  18.92 27.18 270 top
C21  100nF  [LQ_R0603]  13.46 5.08 270 top
C22  12pF  [LQ_R0603]  50.04 32 180 top
C23  100nF  [LQ_R0603]  79.76 20.32 90 top
C27  10nF  [LQ_R0603]  20.83 37.21 0 top
C32  10uF  [LQ_R0603]  13.08 55.63 270 top
C33  100nF  [LQ_R0603]  14.73 55.63 270 top
C34  10uF  [LQ_C0805]  26.03 32.39 180 top
C35  470uF  [LQ_CAP-SMD_BD8.0-L8.3-W8.3-FD]  6.86 23.11 180 top
C37  10uF  [LQ_R0603]  8.64 59.18 180 top
C38  100nF  [LQ_R0603]  30.1 20.45 90 top
C39  100nF  [LQ_R0603]  82.3 17.53 0 top
CN1  -  [LQ_CONN-TH_2P-P5.08_DB128L-5.08-2P]  43.81 54.36 0 top
CN2  -  [LQ_CONN-TH_5P-P2.54_XH-5AW_C2908614]  55.88 4.83 180 top
CN3  -  [LQ_CONN-TH_5P-P2.54_XH-5AW_C2908614]  40.64 4.83 180 top
CN4  -  [LQ_CONN-TH_3P-P5.00_KF2EDGR-5.0-3P]  85.09 45.08 90 top
CN5  -  [LQ_CONN-TH_2P-P5.08_DB128L-5.08-2P]  55.37 54.36 0 top
D2  1N4007  [LQ_SMA_L4.3-W2.5-LS5.0-RD]  66.8 49.4 180 top
D3  SS34  [LQ_SMA_L4.3-W2.6-LS5.0-RD]  27.43 35.43 0 top
D4  SS34  [LQ_SMA_L4.3-W2.6-LS5.0-RD]  26.54 26.29 270 top
D6  -  [LQ_SMB_L4.3-W3.6-LS5.3-RD]  19.05 56.13 90 top
DC1  -  [LQ_DC-IN-TH_DC-005-A200]  6.98 12.7 0 top
F1  -  [LQ_R0805]  16.38 48.13 90 top
F2  -  [LQ_R0805]  26.67 55.88 270 top
F3  -  [LQ_R0603]  19.81 13.72 180 top
H3  -  [LQ_HDR-TH_8P-P2.54-V-F-R2-C4-S2.54-1]  62.74 22.22 180 top
L1  15uH  [LQ_IND-SMD_L10.8-W10.0_SLO1040H]  6.6 48.01 180 top
LED1  -  [LQ_LED0603-RD]  14.86 57.91 0 top
M1  -  [LQ_M3螺丝]  3.5 3.5 0 top
M2  -  [LQ_M3螺丝]  86.87 3.3 0 top
M3  -  [LQ_M3螺丝]  86.5 56.5 0 top
M4  -  [LQ_M3螺丝]  3.5 56.5 0 top
Q1  -  [LQ_SC-75-3_L1.6-W0.8-P1.00-LS1.6-BR]  33.78 50.8 0 top
Q2  S8050-J3Y  [LQ_SOT-23-3_L3.0-W1.7-P0.95-LS2.9-BR]  72.9 24 270 top
Q3  S8050-J3Y  [LQ_SOT-23-3_L3.0-W1.7-P0.95-LS2.9-BR]  76.2 24 270 top
R1  10kΩ  [LQ_R0603]  59.56 32.51 180 top
R2  10kΩ  [LQ_R0603]  14.6 48.21 90 top
R5  10kΩ  [LQ_R0603]  32.77 47.62 270 top
R6  120Ω  [LQ_R0805]  28.57 55.83 90 top
R7  1kΩ  [LQ_R0603]  34.43 47.51 90 top
R8  10kΩ  [LQ_R0603]  35.81 47.5 90 top
R9  10kΩ  [LQ_R0603]  23.37 55.5 90 top
R10  2kΩ  [LQ_R0603]  38.74 40 270 top
R12  4.7kΩ  [LQ_R0603]  50.93 27.05 0 top
R13  4.7kΩ  [LQ_R0603]  50.93 28.58 0 top
R14  4.7kΩ  [LQ_R0603]  78.24 20.31 90 top
R15  2kΩ  [LQ_R0603]  73.53 20.32 270 top
R16  4.7kΩ  [LQ_R0603]  70.49 23.88 90 top
R17  2kΩ  [LQ_R0603]  68.2 51.82 180 top
R18  10K  [LQ_R0603]  68.96 24.13 270 top
R19  1kΩ  [LQ_R0603]  72.26 58.55 180 top
R20  4.7kΩ  [LQ_R0603]  76.58 20.32 90 top
R21  2kΩ  [LQ_R0603]  74.93 20.32 270 top
R22  4.7kΩ  [LQ_R0603]  78.6 23.88 90 top
R23  1kΩ  [LQ_R0603]  70.49 53.34 0 top
R24  10kΩ  [LQ_R0603]  71.12 49.15 90 top
R25  10K  [LQ_R0603]  80.13 23.88 270 top
R27  10kΩ  [LQ_R0603]  15.11 5.08 270 top
R30  2kΩ  [LQ_R0603]  16.26 55.63 270 top
R34  68kΩ  [LQ_R0603]  3.81 30.86 0 top
R35  22kΩ  [LQ_R0603]  7.11 30.73 0 top
R38  100kΩ  [LQ_R0603]  31.62 20.45 90 top
R39  10kΩ  [LQ_R0603]  83.05 19.95 90 top
R40  10kΩ  [LQ_R0603]  28.57 20.45 270 top
R41  -  [LQ_RES-TH_L5.1-W4.3-P3.40-D0.5]  86.74 20.19 180 top
RELAY1  -  [LQ_RELAY-TH_SRD-XXVDC-XL-C_1]  70.99 37.59 270 top
SW1  -  [LQ_SW-SMD_L6.0-W3.3-LS8.0]  58.17 40.39 180 top
U1  -  [LQ_SOD-123FL_L2.8-W1.8-LS3.7-BI]  18.54 48.26 90 top
U2  -  [LQ_SOP-8_L4.9-W3.9-P1.27-LS6.0-BL]  28.07 48.39 90 top
U3  -  [LQ_TQFP-48_L7.0-W7.0-P0.50-LS9.0-BL]  42.42 28.58 180 top
U4  -  [LQ_SOD-123FL_L2.8-W1.8-LS3.7-BI]  23.11 48.26 270 top
U7  -  [LQ_SOD-123FL_L2.8-W1.8-LS3.7-BI]  20.83 48.26 90 top
U8  -  [LQ_DIP-18_L23.0-W6.5-P2.54-LS7.6-BL]  45.21 15.11 180 top
U9  -  [LQ_LED-TH_BD3.9-P2.54-RD_GREEN]  42.42 39.5 180 top
U10  -  [LQ_SOIC-8_L5.3-W5.3-P1.27-LS8.0-BL]  33.53 39.88 180 top
U11  AT24C02  [LQ_SOP-8_L4.9-W3.9-P1.27-LS6.0-BL]  55.75 34.04 180 top
U12  -  [LQ_LED-TH_BD3.9-P2.54-RD_GREEN]  66.04 57.66 0 top
U13  -  [LQ_HDR-TH_6P-P2.54-H-R2-C3-S2.54-W10.0_MTP125-203R1]  82.68 12.32 90 top
U14  GX817C-S  [LQ_SOP-4_L6.5-W4.6-P2.54-LS10.2-TR]  76.07 53.59 0 top
U15  -  [LQ_SOT-23-3_L2.9-W1.3-P1.90-LS2.4-BR]  70.61 55.88 270 top
U16  -  [ESOP]  41.4 47.37 270 top
U17  -  [LQ_SOD-123FL_L2.8-W1.8-LS3.7-BI]  8.64 32.89 0 top
U18  -  [LQ_CONN-TH_3P-P5.08_DIBO_DB128V-5.08-3P-X]  24.13 5.84 0 top
U24  -  [LQ_ESOP-8_L4.9-W3.9-P1.27-LS6.0-TL-EP]  20.57 33.66 0 top
U26  -  [LQ_OSC-SMD_4P-L3.2-W2.5-BL]  9.02 55.75 180 top
X1  8MHz  [LQ_OSC-SMD_4P-L3.2-W2.5-BL]  48.77 34.54 180 top

## Footprints (pads in the part's own frame, mm; a bottom-side part is the same pattern mirrored in y, then rotated)
ESOP
  oval 0.8x1.6 smd: 1(0,0)
  rect 0.8x1.6 smd: 2(1.397,0) 3(2.794,0) 4(4.064,0) 5(4.064,5.461) 6(2.794,5.461) 7(1.397,5.461) 8(0,5.461)
  rect 3.3x2.4 smd: 9(2.286,2.667)
LQ_C0805
  rect 1.41x1.35 smd: 1(-1,0) 2(1,0)
LQ_CAP-SMD_BD6.3-L6.6-W6.6-LS7.3-FD-H7.7
  rect 3.5x1.2 smd: 1(-2.67,0) 2(2.67,0)
LQ_CAP-SMD_BD8.0-L8.3-W8.3-FD
  rect 4.2x1.4 smd: 1(-3.267,0) 2(3.267,0)
LQ_CONN-TH_2P-P5.08_DB128L-5.08-2P
  round 2.4 hole 1.6: 1(-2.54,0) 2(2.54,0)
LQ_CONN-TH_3P-P5.00_KF2EDGR-5.0-3P
  round 2.5 hole 1.8: 1(-5,0) 2(0,0) 3(5,0)
LQ_CONN-TH_3P-P5.08_DIBO_DB128V-5.08-3P-X
  round 2.3 hole 1.5: 1(-5.08,0) 2(0,0) 3(5.08,0)
LQ_CONN-TH_5P-P2.54_XH-5AW_C2908614
  rect 1.8x1.8 hole 1.1: 1(-5.08,0)
  round 1.8 hole 1.1: 2(-2.54,0) 3(0,0) 4(2.54,0) 5(5.08,0)
LQ_DC-IN-TH_DC-005-A200
  oval 1.5x3.8 hole 0.9x3.1: 1(3,2.325) 2(-3,2.325)
  oval 3.4x1.5 hole 2.6x0.9: 3(0.5,-2.325)
LQ_DIP-18_L23.0-W6.5-P2.54-LS7.6-BL
  rect 1.6x1.6 hole 1: 1(-10.16,-3.81)
  round 1.6 hole 1: 2(-7.62,-3.81) 3(-5.08,-3.81) 4(-2.54,-3.81) 5(0,-3.81) 6(2.54,-3.81) 7(5.08,-3.81) 8(7.62,-3.81) 9(10.16,-3.81) 10(10.16,3.81) 11(7.62,3.81) 12(5.08,3.81) 13(2.54,3.81) 14(0,3.81) 15(-2.54,3.81) 16(-5.08,3.81) 17(-7.62,3.81) 18(-10.16,3.81)
LQ_ESOP-8_L4.9-W3.9-P1.27-LS6.0-TL-EP
  rect 1.3x0.6 smd: 1(-2.7,1.905) 2(-2.7,0.635) 3(-2.7,-0.635) 4(-2.7,-1.905) 5(2.7,-1.905) 6(2.7,-0.635) 7(2.7,0.635) 8(2.7,1.905)
  rect 2.5x3.5 smd: 9(0,0)
LQ_HDR-TH_6P-P2.54-H-R2-C3-S2.54-W10.0_MTP125-203R1
  rect 1.7x1.7 hole 1.2: 1(-2.54,1.27)
  round 1.7 hole 1.2: 2(-2.54,-1.27) 3(0,1.27) 4(0,-1.27) 5(2.54,1.27) 6(2.54,-1.27)
LQ_HDR-TH_8P-P2.54-V-F-R2-C4-S2.54-1
  rect 1.6x1.6 hole 1.1: 1(-3.81,-1.27)
  round 1.6 hole 1.1: 2(-3.81,1.27) 3(-1.27,-1.27) 4(-1.27,1.27) 5(1.27,-1.27) 6(1.27,1.27) 7(3.81,-1.27) 8(3.81,1.27)
LQ_IND-SMD_L10.8-W10.0_SLO1040H
  rect 2.924x3.42 smd: 1(4.778,0) 2(-4.778,0)
LQ_LED0603-RD
  rect 0.8x0.8 smd: 1(-0.799,0) 2(0.799,0)
LQ_LED-TH_BD3.9-P2.54-RD_GREEN
  round 1.6 hole 0.9: 1(-1.27,0) 2(1.27,0)
LQ_M3螺丝
  round 3.2 hole 3.2: 1(0,0)
LQ_OSC-SMD_4P-L3.2-W2.5-BL
  rect 1.4x1.2 smd: 1(-1.1,-0.875) 2(1.1,-0.875) 3(1.1,0.875) 4(-1.1,0.875)
LQ_R0603
  rect 0.806x0.864 smd: 1(-0.753,0) 2(0.753,0)
LQ_R0805
  rect 1.133x1.377 smd: 1(-1,0) 2(1,0)
LQ_RELAY-TH_SRD-XXVDC-XL-C_1
  round 2.794 hole 1.524: 1(-5.1,-6) 2(7.1,-6) 3(7.1,6) 4(-5.1,6) 5(-7.1,0)
LQ_RES-TH_L5.1-W4.3-P3.40-D0.5
  round 1.524 hole 0.762: 1(0,1.7) 2(0,-1.7)
LQ_SC-75-3_L1.6-W0.8-P1.00-LS1.6-BR
  rect 0.816x0.4 smd: 1(0.65,-0.5) 2(0.65,0.5) 3(-0.65,0)
LQ_SMA_L4.3-W2.5-LS5.0-RD
  rect 2x1.593 smd: 1(-2.1,0) 2(2.1,0)
LQ_SMA_L4.3-W2.6-LS5.0-RD
  rect 2.046x1.62 smd: 1(-2.404,-0.009) 2(2.404,0.009)
LQ_SMB_L4.3-W3.6-LS5.3-RD
  rect 2.5x2.3 smd: 1(-2.15,0) 2(2.15,0)
LQ_SOD-123FL_L2.8-W1.8-LS3.7-BI
  rect 1.2x1.4 smd: 1(-1.7,0) 2(1.7,0)
LQ_SOIC-8_L5.3-W5.3-P1.27-LS8.0-BL
  oval 0.63x2.25 smd: 1(-1.905,-3.53) 2(-0.635,-3.53) 3(0.635,-3.53) 4(1.905,-3.53) 5(1.905,3.53) 6(0.635,3.53) 7(-0.635,3.53) 8(-1.905,3.53)
LQ_SOP-4_L6.5-W4.6-P2.54-LS10.2-TR
  rect 1.8x2 smd: 1(1.27,5.1) 2(-1.27,5.1) 3(-1.27,-5.1) 4(1.27,-5.1)
LQ_SOP-8_L4.9-W3.9-P1.27-LS6.0-BL
  oval 0.63x1.865 smd: 1(-1.905,-2.683) 2(-0.635,-2.683) 3(0.635,-2.683) 4(1.905,-2.683) 5(1.905,2.683) 6(0.635,2.683) 7(-0.635,2.683) 8(-1.905,2.683)
LQ_SOT-23-3_L2.9-W1.3-P1.90-LS2.4-BR
  rect 1.25x0.7 smd: 1(1,-0.95) 2(1,0.95) 3(-1,0)
LQ_SOT-23-3_L3.0-W1.7-P0.95-LS2.9-BR
  rect 1.038x0.532 smd: 1(1.101,-0.95) 2(1.101,0.95) 3(-1.101,0)
LQ_SW-SMD_L6.0-W3.3-LS8.0
  rect 1.9x1.5 smd: 1(-4,0) 2(4,0)
LQ_TQFP-48_L7.0-W7.0-P0.50-LS9.0-BL
  oval 0.28x1.8 smd: 1(-2.75,-4.05) 2(-2.25,-4.05) 3(-1.75,-4.05) 4(-1.25,-4.05) 5(-0.75,-4.05) 6(-0.25,-4.05) 7(0.25,-4.05) 8(0.75,-4.05) 9(1.25,-4.05) 10(1.75,-4.05) 11(2.25,-4.05) 12(2.75,-4.05) 25(2.75,4.05) 26(2.25,4.05) 27(1.75,4.05) 28(1.25,4.05) 29(0.75,4.05) 30(0.25,4.05) 31(-0.25,4.05) 32(-0.75,4.05) 33(-1.25,4.05) 34(-1.75,4.05) 35(-2.25,4.05) 36(-2.75,4.05)
  oval 1.8x0.28 smd: 13(4.05,-2.75) 14(4.05,-2.25) 15(4.05,-1.75) 16(4.05,-1.25) 17(4.05,-0.75) 18(4.05,-0.25) 19(4.05,0.25) 20(4.05,0.75) 21(4.05,1.25) 22(4.05,1.75) 23(4.05,2.25) 24(4.05,2.75) 37(-4.05,2.75) 38(-4.05,2.25) 39(-4.05,1.75) 40(-4.05,1.25) 41(-4.05,0.75) 42(-4.05,0.25) 43(-4.05,-0.25) 44(-4.05,-0.75) 45(-4.05,-1.25) 46(-4.05,-1.75) 47(-4.05,-2.25) 48(-4.05,-2.75)

## Nets
As in the schematic.

Pads without a net: U3 3 4 38 39 44 45 46; U10 3 7; U16 8; U24 2 3 5

## Via types
v1: diameter 0.635, hole 0.381, Top Layer to Bottom Layer, 80 vias

## Routing (per net, layer and track width the routed paths; a pad name or vN(x,y) marks a point on that pad's centre or on a via; arc(x,y) is an arc through that point)
3V3: length 195.7
  Top Layer w0.254: v1(22.61,9.53) 24.01,9.53 24.13,9.64 ; C16.1 39.5,46.24 39.5,41.52 R10.1 C17.2 35.43,38.85 U10.8 39.9,36.35 v1(40.61,35.64) 40.76,35.49 40.76,35.45 41.14,35.07 41.14,32.53 41.17,32.5 ; C16.1 39.88,46.87 36.99,46.87 36.37,47.49 33.86,47.49 33.24,46.87 R5.2 32.77,46.27 31.06,44.57 27.3,44.57 U2.8 25.74,46.48 26.65,47.39 26.65,51.84 24.89,53.59 C1.1 R9.1 C2.1 21.24,54.14 19.06,54.14 18.32,54.87 R30.2 C33.2 C32.2 13.08,54.88 U26.4 9.67,54.88 8.95,55.6 8.95,55.61 8.75,55.81 8.74,55.81 U26.2 ; C16.1 40.14,46.61 41.15,46.61 41.66,46.1 ; R13.2 51.68,27.18 ; R13.2 51.81,28.45 v1(52.83,28.45) ; R13.2 51.68,29.84 52.07,29.84 52.58,29.34 56.13,29.34 57.66,30.86 ; C7.2 33.65,24.89 v1(32.13,24.89) ; R27.2 C21.2 ; R1.2 58.81,32.5 U11.8 57.66,30.86 ; C10.1 38.25,24.88 v1(39.01,24.13) ; C10.1 38.37,25.28 38.37,25.7 ; C10.1 C9.1 C8.1 33.91,24.88 ; v1(70.94,19.43) 71.86,19.43 C11.1 73.52,19.58 R15.2 R21.2 R20.1 C23.1 81.91,19.57 83.05,20.7 ; v1(45.64,34.56) 45.64,33.1 U3.1 U3.48 48.66,31.33 48.74,31.24 50.28,31.24 C12.1 ; 45.17,24.4 45.44,24.13 v1(46.1,24.13) ; 57.66,30.86 57.66,29.21 63.37,23.5 64.01,23.5 H3.4 ; 24.13,9.64 C13.2 ; 24.13,9.64 U18.2 22.65,4.36 15.11,4.36
  Bottom Layer w0.254: H3.4 v1(64.01,19.18) 64.52,18.67 70.18,18.67 v1(70.94,19.43) ; v1(32.13,24.89) 22.61,15.37 v1(22.61,9.53) ; v1(52.83,28.45) 52.76,28.37 47.8,28.37 47.62,28.19 47.62,25.65 v1(46.1,24.13) 45.59,23.62 39.51,23.62 v1(39.01,24.13) ; v1(40.61,35.64) 41.68,36.7 42.9,36.7 43.95,35.65 43.95,34.55 44.26,34.24 45.21,34.24 45.53,34.56 v1(45.64,34.56)
+5V: length 240.5
  Top Layer w0.254: D2.1 68.95,49.45 R17.1 ; D2.1 68.9,47.49 64.96,43.54 ; D2.1 70.36,47.95 70.36,47.86 70.94,47.27 71.67,47.27 72.46,46.48 77.22,46.48 78.1,47.37 78.1,47.73 U14.4 ; 84.96,42.67 84.96,47.24 81.89,50.31 81.89,50.74 80.81,51.82 79.12,51.82 78.73,51.43 78.73,49.63 77.6,48.49 ; 84.96,42.67 84.96,42.42 ; 84.96,42.67 89.03,38.6 89.03,26.16 86.73,23.86 79.56,23.86 78.83,23.13 R22.1 78.6,23.12 78.18,23.12 77.55,23.75 71.54,23.75 70.92,23.12 R16.1 69.42,22.06 69.42,19.48 73.41,15.49 75.53,15.49 76.22,16.18 77.2,16.18 77.89,15.49 77.89,14.51 77.2,13.82 75.29,13.82 75.18,13.72 75.18,13.46 70.23,8.51 63.23,8.51 62,7.28 52.83,7.28 51.6,8.51 50.8,8.51 50.8,8 49.91,7.11 36.96,7.11 35.56,8.51 35.56,10.79 U8.10 32.7,11.3 32.25,11.76 32.18,11.76 32,11.94 22.34,11.94 F3.1 20.57,15.45 C14.2 C15.2 ; C37.2 6.89,58.19 6.89,55.89 7.08,55.7 7.1,55.7 U26.3 7.92,54.1 L1.1 ; C4.1 3.06,38.59 C3.2
  Top Layer w0.508: L1.1 1.83,43.48 0.51,42.16 0.51,35.32 C3.2 ; C3.2 3.9,33.6 3.9,33.63 4.17,33.9 5.96,33.9 6.23,33.63 6.23,33.6 U17.1 ; C3.2 3.06,32.76 R34.1 0.76,28.57 0.76,19.43 1.32,18.88 17.84,18.88 18.02,19.05 19.25,19.05 19.43,18.88 19.45,18.88 20.56,17.77 C15.2
+5V-OUT: length 74
  Top Layer w0.254: 38.85,0.55 41.53,0.57 ; 76.71,12.46 79.25,12.46
  Top Layer w0.508: 41.53,0.57 41.51,0.59 64.84,0.59 76.71,12.46 ; F3.2 18.77,13.43 18.77,12.71 20.16,11.32 31.72,11.32 32.67,10.37 32.67,6.24 38.31,0.59 38.85,0.59
+12V: length 59.8
  Top Layer w0.254: C34.2 26.42,31 26.42,29.28 26.74,28.96 ; C34.2 24.25,31.6 24.25,31.31 24.06,31.12 23.77,31.12 20.58,27.93 C20.1 C19.2 12.45,23.11 C35.1 ; C34.2 28.66,36.01 28.66,36.39 34.22,41.95 35.7,41.95 37.69,43.94 37.72,43.94 v1(38.48,44.7) ; C34.2 25.03,33.3 23.9,34.44 ; C18.1 48.29,42.58 45.93,42.58 45.45,43.05 42.78,43.05 42.54,43.3 42.54,43.84 41.67,44.7 v1(40.26,44.7)
  Bottom Layer w0.254: v1(38.48,44.7) v1(40.26,44.7)
GND: length 244.1
  Top Layer w0.254: v1(72.9,54.86) 72.88,54.88 U15.2 ; H3.2 v1(66.55,19.34) ; R24.1 72.51,48.4 v1(72.84,48.72) ; 86.87,18.49 87.3,18.49 v1(88.65,17.14) ; v1(46.82,23.17) 45.1,23.17 44.7,23.57 44.7,24.5 U3.35 ; C39.2 85.04,17.53 v1(85.46,17.11) ; v1(44.7,37.08) 42.29,37.08 41.34,36.13 41.34,35.88 41.67,35.55 41.67,32.5 ; U2.5 25.38,50.43 v1(24.26,51.56) ; v1(24.3,55.7) 24.34,55.7 C1.2 ; v1(70.88,21.13) 71.95,21.13 C11.2 ; 62.03,40.37 72.41,40.37 v1(72.9,39.88) ; U3.23 33.8,26.33 33.53,26.06 32.62,26.06 32.35,26.33 32.13,26.33 v1(30.84,25.03) ; C37.1 12.79,59.18 v1(13.1,58.87) LED1.1 ; v1(30.65,51.49) 30.75,51.39 U2.4 31.79,51.33 33.68,51.33 33.71,51.3 Q1.2 35.57,51.3 v1(37.59,49.28) 38.98,49.28 C16.2 40.52,48.25 U16.1 ; v1(37.59,45.97) 36.58,45.97 R8.1 ; C34.1 29.08,32.39 v1(29.84,33.15) 30.01,33.32 30.01,35.45 ; 19.06,58.44 19.83,58.44 20.7,59.31 21.21,59.31 v1(21.65,58.86) 21.65,56.44 C2.2 ; U7.1 21.35,46.56 23.8,44.11 30.92,44.11 U10.4 31.52,43.31 v1(29.46,43.31) ; C10.2 C9.2 C8.2 34.92,23.24 33.52,23.24 ; C14.1 C15.1 18.22,17.4 v1(16.51,17.4) ; v1(81.53,22.1) 80.51,21.07 C23.2 ; X1.4 51.42,33.67 52.07,33.02 v1(52.07,32) C22.1 ; v1(32,23.24) 33.52,23.24 ; 33.52,23.24 C7.1 ; C12.2 49.67,30.35 v1(48.26,30.35) 47.79,30.83 U3.47 ; C20.2 C19.1 18.67,25.03 v1(19.43,25.03)
  Bottom Layer w0.254: 79.25,9.92 85.87,3.3 M2.1 88.65,5.08 v1(88.65,17.14) 88.61,17.11 v1(85.46,17.11) ; v1(16.51,17.4) 19.43,20.32 v1(19.43,25.03) ; v1(21.65,58.86) 24.3,56.22 v1(24.3,55.7) 24.26,55.66 v1(24.26,51.56) 30.57,51.56 v1(30.65,51.49) ; v1(74.68,58.67) 74.68,56.64 v1(72.9,54.86) 72.84,54.81 v1(72.84,48.72) 72.9,48.66 v1(72.9,39.88) ; M4.1 3.92,56.5 6.29,58.87 v1(13.1,58.87) ; v1(52.07,32) 50.42,30.35 v1(48.26,30.35) ; v1(81.53,22.1) 85.46,18.17 v1(85.46,17.11) ; v1(29.84,33.15) 29.84,42.93 v1(29.46,43.31) ; v1(85.46,17.11) 84.49,18.08 76.44,18.08 73.39,21.13 v1(70.88,21.13) 69.08,19.34 v1(66.55,19.34) ; v1(37.59,45.97) v1(37.59,49.28)
VIN: length 24.1
  Top Layer w0.254: R38.2 28.67,24.15 26.76,24.15 ; v1(25.3,21.83) 26.56,23.09 26.56,23.71
  Bottom Layer w0.254: 13.48,12.7 22.63,21.84 25.28,21.84 v1(25.3,21.83)
485_A: length 14.8
  Top Layer w0.254: F2.2 28.52,54.88 R6.1 40.8,54.83 CN1.1
485_B: length 41.1
  Top Layer w0.254: v1(28.57,59.14) R6.2 43.88,56.83 CN1.2 ; F1.2 v1(16.38,50.92)
  Bottom Layer w0.254: v1(16.38,50.92) 20.45,54.99 20.45,58.67 21.34,59.56 28.32,59.56 28.57,59.31 v1(28.57,59.14)
485_RX: length 27.4
  Top Layer w0.254: v1(30.87,26.9) 30.95,26.83 32.5,26.83 32.81,26.52 33.34,26.52 33.65,26.83 U3.22 ; U2.1 30.75,45.35 v1(30.73,45.34)
  Bottom Layer w0.254: v1(30.73,45.34) 30.73,27.04 v1(30.87,26.9)
485_TX: length 26
  Top Layer w0.254: U3.21 33.24,27.33 v1(33.08,27.17) ; v1(33.38,45.62) 34.43,46.66 34.43,46.75
  Bottom Layer w0.254: v1(33.08,27.17) 32.89,27.35 32.85,27.35 32.51,27.69 32.51,44.75 v1(33.38,45.62)
ADC_IN0: length 27.3
  Top Layer w0.254: R40.2 C38.1 R38.1 32.39,19.69 33.53,20.83 v1(36.96,20.83) ; v1(40.49,34.8) 40.67,34.62 40.67,32.5
  Bottom Layer w0.254: v1(40.49,34.8) 39.38,34.8 38.35,33.77 38.35,22.22 v1(36.96,20.83)
ADC_IN1: length 59.8
  Top Layer w0.254: 40.17,32.5 40.17,33.75 v1(39.88,34.04) ; v1(81.65,18.73) 81.65,17.63 ; 81.65,17.63 83.05,19.03 R39.1 84.17,19.19 86.87,21.89 ; 81.65,17.63 C39.1
  Bottom Layer w0.254: v1(39.88,34.04) 43.17,34.04 43.88,33.33 46.04,33.33 46.75,34.04 68.2,34.04 81.65,20.59 v1(81.65,18.73)
I2C_SCL: length 13.9
  Top Layer w0.254: v1(55.12,30) U11.6 ; 55.12,28.45 55.12,27.43 53.97,26.29 50.94,26.29 R12.1 48.9,28.33 U3.42
  Bottom Layer w0.254: v1(55.12,28.42) v1(55.12,30)
I2C_SDA: length 10.7
  Top Layer w0.254: R13.1 49.92,28.83 49.03,28.83 ; v1(48.51,29.35) 49.03,28.83 ; 49.03,28.83 U3.43 ; v1(52.83,30.86) 53.36,30.86 U11.5
  Bottom Layer w0.254: v1(48.51,29.35) 51.32,29.35 v1(52.83,30.86)
MOT1_INA: length 23.1
  Top Layer w0.254: v1(37.34,35.31) 39.67,32.98 39.67,32.5 ; v1(48.74,44.65) 48.69,44.7 47.12,44.7
  Bottom Layer w0.254: v1(48.74,44.65) 48.77,44.63 48.77,43.56 47.12,41.91 41.02,41.91 40,40.89 40,37.97 v1(37.34,35.31)
MOT1_INB: length 25.4
  Top Layer w0.254: v1(36.72,31.75) 37.94,31.75 U3.13 ; v1(48.51,45.8) 48.21,46.1 47.12,46.1
  Bottom Layer w0.254: v1(48.51,45.8) 49.58,44.73 49.58,43.23 46.98,40.63 43.22,40.63 42.56,39.97 42.56,39.31 36.72,33.47 v1(36.72,31.75)
MOT1_OUTA: length 19.2
  Top Layer w0.254: 41.66,43.43 40.99,43.43 v1(40.22,42.67)
  Bottom Layer w0.254: CN5.1 51.92,54.36 v1(40.22,42.67)
MOT1_OUTB: length 16.8
  Top Layer w0.254: v1(47.89,43.67) 47.66,43.43 47.12,43.43
  Bottom Layer w0.254: v1(47.89,43.67) 47.87,43.7 47.87,46.07 48.51,46.71 48.51,46.74 56.13,54.36 CN5.2
MOT_A1: length 3
  Top Layer w0.254: 38.1,8.51 38.1,10.79 U8.11
MOT_A2: length 3
  Top Layer w0.254: U8.12 40.64,10.79 40.64,8.51
MOT_A3: length 3
  Top Layer w0.254: U8.13 43.18,10.79 43.18,8.51
MOT_A4: length 3
  Top Layer w0.254: 45.72,8.51 45.72,10.79 U8.14
MOT_B1: length 6.7
  Top Layer w0.254: U8.15 49.32,9.74 51.31,9.74 52.54,8.51 53.34,8.51
MOT_B2: length 6.7
  Top Layer w0.254: 55.88,8.51 55.25,9.14 54.44,9.14 53.85,9.74 52.11,9.74 50.55,11.3 U8.16
MOT_B3: length 6.7
  Top Layer w0.254: U8.17 53.21,11.3 54.78,9.74 57.19,9.74 58.42,8.51
MOT_B4: length 6.7
  Top Layer w0.254: 60.96,8.51 58.17,11.3 U8.18
OSC_IN: length 10.5
  Top Layer w0.254: C22.2 49.08,32 46.97,34.11 46.58,34.11 46.38,34.3 46.38,34.68 46.28,34.79 46.28,35.13 45.85,35.56 43.56,35.56 43.17,35.17 43.17,32.88
OSC_OUT: length 13.8
  Top Layer w0.254: 47.12,38.87 47.12,38.35 44.78,36.02 43.37,36.02 42.67,35.31 42.67,32.5 ; 47.12,38.87 49.87,36.12 X1.1 ; 47.12,38.87 C6.1
PB0/DS18B20: length 41.2
  Top Layer w0.254: U3.18 34.04,28.83 33.15,29.72 30.01,29.72 v1(29.97,29.76)
  Top Layer w0.508: U18.1 19.04,5.83 R27.1
  Bottom Layer w0.254: U18.1 19.05,13.46 29.97,24.38 v1(29.97,29.76)
PB4/PWM1: length 39.3
  Top Layer w0.254: U3.40 47.59,27.33 48.01,26.9 48.72,26.9 v1(48.77,26.85) ; v1(72.9,22.35) 73.3,22.35 Q2.2 ; v1(78.24,22.09) R14.2
  Bottom Layer w0.254: v1(48.77,26.85) 49,26.61 49,25.67 49.38,25.29 50.33,25.29 50.34,25.27 58.8,25.27 60.34,23.74 60.34,23.03 61,22.36 61.71,22.36 61.72,22.35 72.9,22.35 v1(72.9,22.35) 75.11,20.14 75.11,20.05 75.49,19.67 76.06,19.67 78.24,21.85 v1(78.24,22.09)
PB5/PWM2: length 35.6
  Top Layer w0.254: v1(48.28,27.55) 48,27.83 U3.41 ; Q3.2 77.15,21.64 R20.2 75.83,20.32 v1(75.76,20.32)
  Bottom Layer w0.254: v1(75.76,20.32) 73.55,22.54 73.55,22.62 73.17,23 73.08,23 68.54,27.55 v1(48.28,27.55)
PC13/LED: length 8.2
  Top Layer w0.254: v1(45.59,38.23) 44.32,39.5 U9.1 ; v1(44.73,34.91) 44.7,34.88 44.7,32.91 44.67,32.88
  Bottom Layer w0.254: v1(45.59,38.23) 45.47,38.1 45.47,35.65 v1(44.73,34.91)
PWM1-DOUT: length 14.2
  Top Layer w0.254: R18.2 68.96,18.29 72.25,15 76.71,15
PWM2-DOUT: length 26.1
  Top Layer w0.254: 79.25,15 80.38,16.13 88.77,16.13 89.41,16.76 89.41,22.1 88.14,23.37 80.37,23.37 R25.2
RELAY1: length 58.3
  Top Layer w0.254: R19.2 71.13,58.93 v1(69.98,58.93) ; U3.19 38.34,28.35 33.86,28.35 33.73,28.48 v1(33.47,28.48)
  Bottom Layer w0.254: v1(33.47,28.48) 34.71,28.48 37.47,31.24 37.47,33.53 42.29,38.35 44.14,38.35 45.96,40.17 47.17,40.17 50.43,43.43 52.32,43.43 53.72,44.83 53.72,46.61 54.61,47.5 58.75,47.5 68.44,57.19 68.44,57.39 v1(69.98,58.93)
RST: length 32.5
  Top Layer w0.254: v1(52.52,40.17) 53.83,40.17 54.03,40.37 ; 42.17,32.5 42.17,35.99 v1(42.15,36.01) ; 54.85,37.98 53.78,39.05 53.78,39.73 ; C5.1 R1.1 58.3,34.53 58.3,37.6 57.93,37.98 54.85,37.98
  Bottom Layer w0.254: v1(52.52,40.17) 52.23,40.17 45.85,33.78 44.07,33.78 42.15,35.7 v1(42.15,36.01)
SPI_CS: length 17.4
  Top Layer w0.254: v1(36.05,31.23) 36.32,31.23 36.69,30.86 38.34,30.86 U3.14 ; v1(36.19,44.58) 36.19,44.17 U10.1
  Bottom Layer w0.254: v1(36.19,44.58) 36.07,44.45 36.07,31.78 36.06,31.76 36.06,31.23
SPI_MISO: length 20.6
  Top Layer w0.254: 34.16,43.41 34.16,45.22 v1(34.17,45.22) ; U3.16 35.55,29.83 v1(34.21,31.17)
  Bottom Layer w0.254: v1(34.17,45.22) 34.17,31.21 v1(34.21,31.17)
SPI_MOSI: length 11.7
  Top Layer w0.254: U10.5 31.62,32.84 35.14,29.33 U3.17
SPI_SCK: length 9.7
  Top Layer w0.254: U10.6 32.89,33.4 35.97,30.33 U3.15
STEP_A1: length 18.3
  Top Layer w0.254: U3.20 38.36,27.81 v1(31.5,27.81)
  Bottom Layer w0.254: v1(31.5,27.81) 31.5,27.19 32.78,25.91 32.78,23.74 U8.8
STEP_A2: length 5.7
  Top Layer w0.254: 39.67,24.4 39.67,19.39 U8.7
STEP_A3: length 6.7
  Top Layer w0.254: 40.17,24.4 40.17,21.05 42.29,18.92 U8.6
STEP_A4: length 8.7
  Top Layer w0.254: 40.67,24.4 40.67,21.21 41.82,20.05 42.41,20.05 42.42,20.07 44.07,20.07 U8.5
STEP_B1: length 10.6
  Top Layer w0.254: U8.4 46.15,20.52 42.09,20.52 41.17,21.44 41.17,24.4
STEP_B2: length 12.5
  Top Layer w0.254: U8.3 48.23,20.98 42.28,20.98 41.66,21.6 41.66,21.84 41.67,21.86 41.67,24.4
STEP_B3: length 13.1
  Top Layer w0.254: U8.2 51.82,18.92 51.42,19.32 51.42,19.39 49.38,21.44 44.3,21.44 43.49,22.25 43.49,22.43 43.46,22.45 43.46,22.81 43.16,23.12 43.16,24.39 43.17,24.4
STEP_B4: length 15
  Top Layer w0.254: U8.1 54.74,18.92 51.91,21.75 49.71,21.75 49.46,22 44.38,22 43.94,22.44 43.94,22.98 43.61,23.31 43.61,23.42 43.64,23.44 43.64,24.37 43.67,24.4
SWCLK: length 16.1
  Top Layer w0.254: 46.47,25.7 49.41,25.7 v1(49.65,25.94)
  Bottom Layer w0.254: 61.47,23.5 59.03,25.94 v1(49.65,25.94)
SWDIO: length 17.5
  Top Layer w0.254: 44.17,24.4 44.14,24.37 44.14,23.43 45.11,22.46 51.85,22.46 52.61,21.7 57.51,21.7 58.93,23.11 58.93,23.5
UART1_RXD: length 21.2
  Top Layer w0.254: 42.67,24.4 42.67,22.69 v1(42.82,22.54)
  Bottom Layer w0.254: H3.6 60.32,22.1 56.64,22.1 56.22,22.52 47.09,22.52 47.08,22.52 46.55,22.52 46.53,22.54 v1(42.82,22.54)
UART1_TXD: length 19.8
  Top Layer w0.254: 42.17,24.4 42.17,22 v1(42.44,21.73)
  Bottom Layer w0.254: H3.8 58.67,20.7 56.13,20.7 55.1,21.73 v1(42.44,21.73)
$1N1864: length 2.5
  Top Layer w0.254: U9.2 40.9,39.25 R10.2
$1N51292: length 2
  Top Layer w0.254: Q3.1 75.25,21.39 R21.1
$1N51297: length 4.1
  Top Layer w0.254: Q3.3 78.14,25.1 R22.2 R25.1
$1N64291: length 6.1
  Top Layer w0.254: Q1.3 33.13,48.74 R5.1 32.14,47.75 U2.2 U2.3
$1N64303: length 12.4
  Top Layer w0.254: R2.1 14.93,47.13 F1.1 17.97,47.13 U1.1 19.06,46.56 19.99,47.49 21.67,47.49 22.59,46.56 U4.2 23.42,46.86 24.13,46.86 25.02,47.75 U2.7
$1N64306: length 16.3
  Top Layer w0.254: U7.2 U4.1 ; U4.1 24.13,49.96 25.07,49.02 U2.6 ; U4.1 23.11,51.74 v1(22.9,51.96) ; F2.1 26.85,57.06 26.85,57.35 26.67,57.53 24.65,57.53 R9.2 22.77,55.66 v1(22.76,55.66)
  Bottom Layer w0.254: v1(22.9,51.96) 22.9,55.52 v1(22.76,55.66)
$1N64546: length 3.4
  Top Layer w0.254: Q1.1 34.43,48.27 R7.2 35.81,48.26 R8.2
$1N100307: length 6.3
  Top Layer w0.254: R23.2 74.8,49.78 U14.3
$1N100313: length 21.6
  Top Layer w0.254: 76.96,31.34 82.04,36.43 82.04,47.88 80.31,49.61 80.31,50.08
$1N100314: length 5.6
  Top Layer w0.254: R24.2 71.12,51.95 R23.1 69.73,54.81 U15.1
$1N100315: length 37.4
  Top Layer w0.254: U15.3 69.83,57.66 68.91,57.66 67.78,58.79 66.84,58.79 65.71,57.66 U12.1 64.7,57.59 D2.2 64.7,45.73 63.23,44.26 63.23,42.83 64.24,41.81 65.67,41.81 67.4,43.54 76.96,43.54
$1N100316: length 19
  Top Layer w0.254: 64.96,31.34 71.57,31.34 80.31,40.08
$1N100317: length 9.5
  Top Layer w0.254: 70.96,45.54 79.85,45.54 80.31,45.08
$1N101166: length 7.9
  Top Layer w0.254: U14.1 77.34,58.42 74.8,55.88 73.79,55.88 73.02,56.65 R19.1
$1N101509: length 6.9
  Top Layer w0.254: Q2.1 71.57,22.9 70.1,21.44 70.1,20.98 70.74,20.35 72.57,20.35 72.76,20.54 72.76,20.55 73.29,21.07 R15.1
$1N101514: length 4.2
  Top Layer w0.254: R18.1 70.23,24.88 R16.2 72.42,24.63 Q2.3
$1N108709: length 5.9
  Top Layer w0.254: R17.2 67.45,57.52 U12.2
$1N118569: length 1.8
  Top Layer w0.254: R30.1 16.26,57.31 LED1.2
$1N118588: length 19
  Top Layer w0.254: L1.2 23.96,35.43 25.21,35.43
$1N118591: length 14.7
  Top Layer w0.254: R34.2 5.58,29.84 7.24,29.84 7.87,30.47 R35.2 16.86,30.73 U24.4
$1N118592: length 2.9
  Top Layer w0.254: C27.1 19.53,37.21 U24.1

## Copper pours and planes (outline as drawn; the poured copper is in the pictures)
GND on Top Layer: -6.33,64.07 102.89,64.07 102.89,-7.43 -6.33,-7.43
